# Altium project RF.PrjPcb
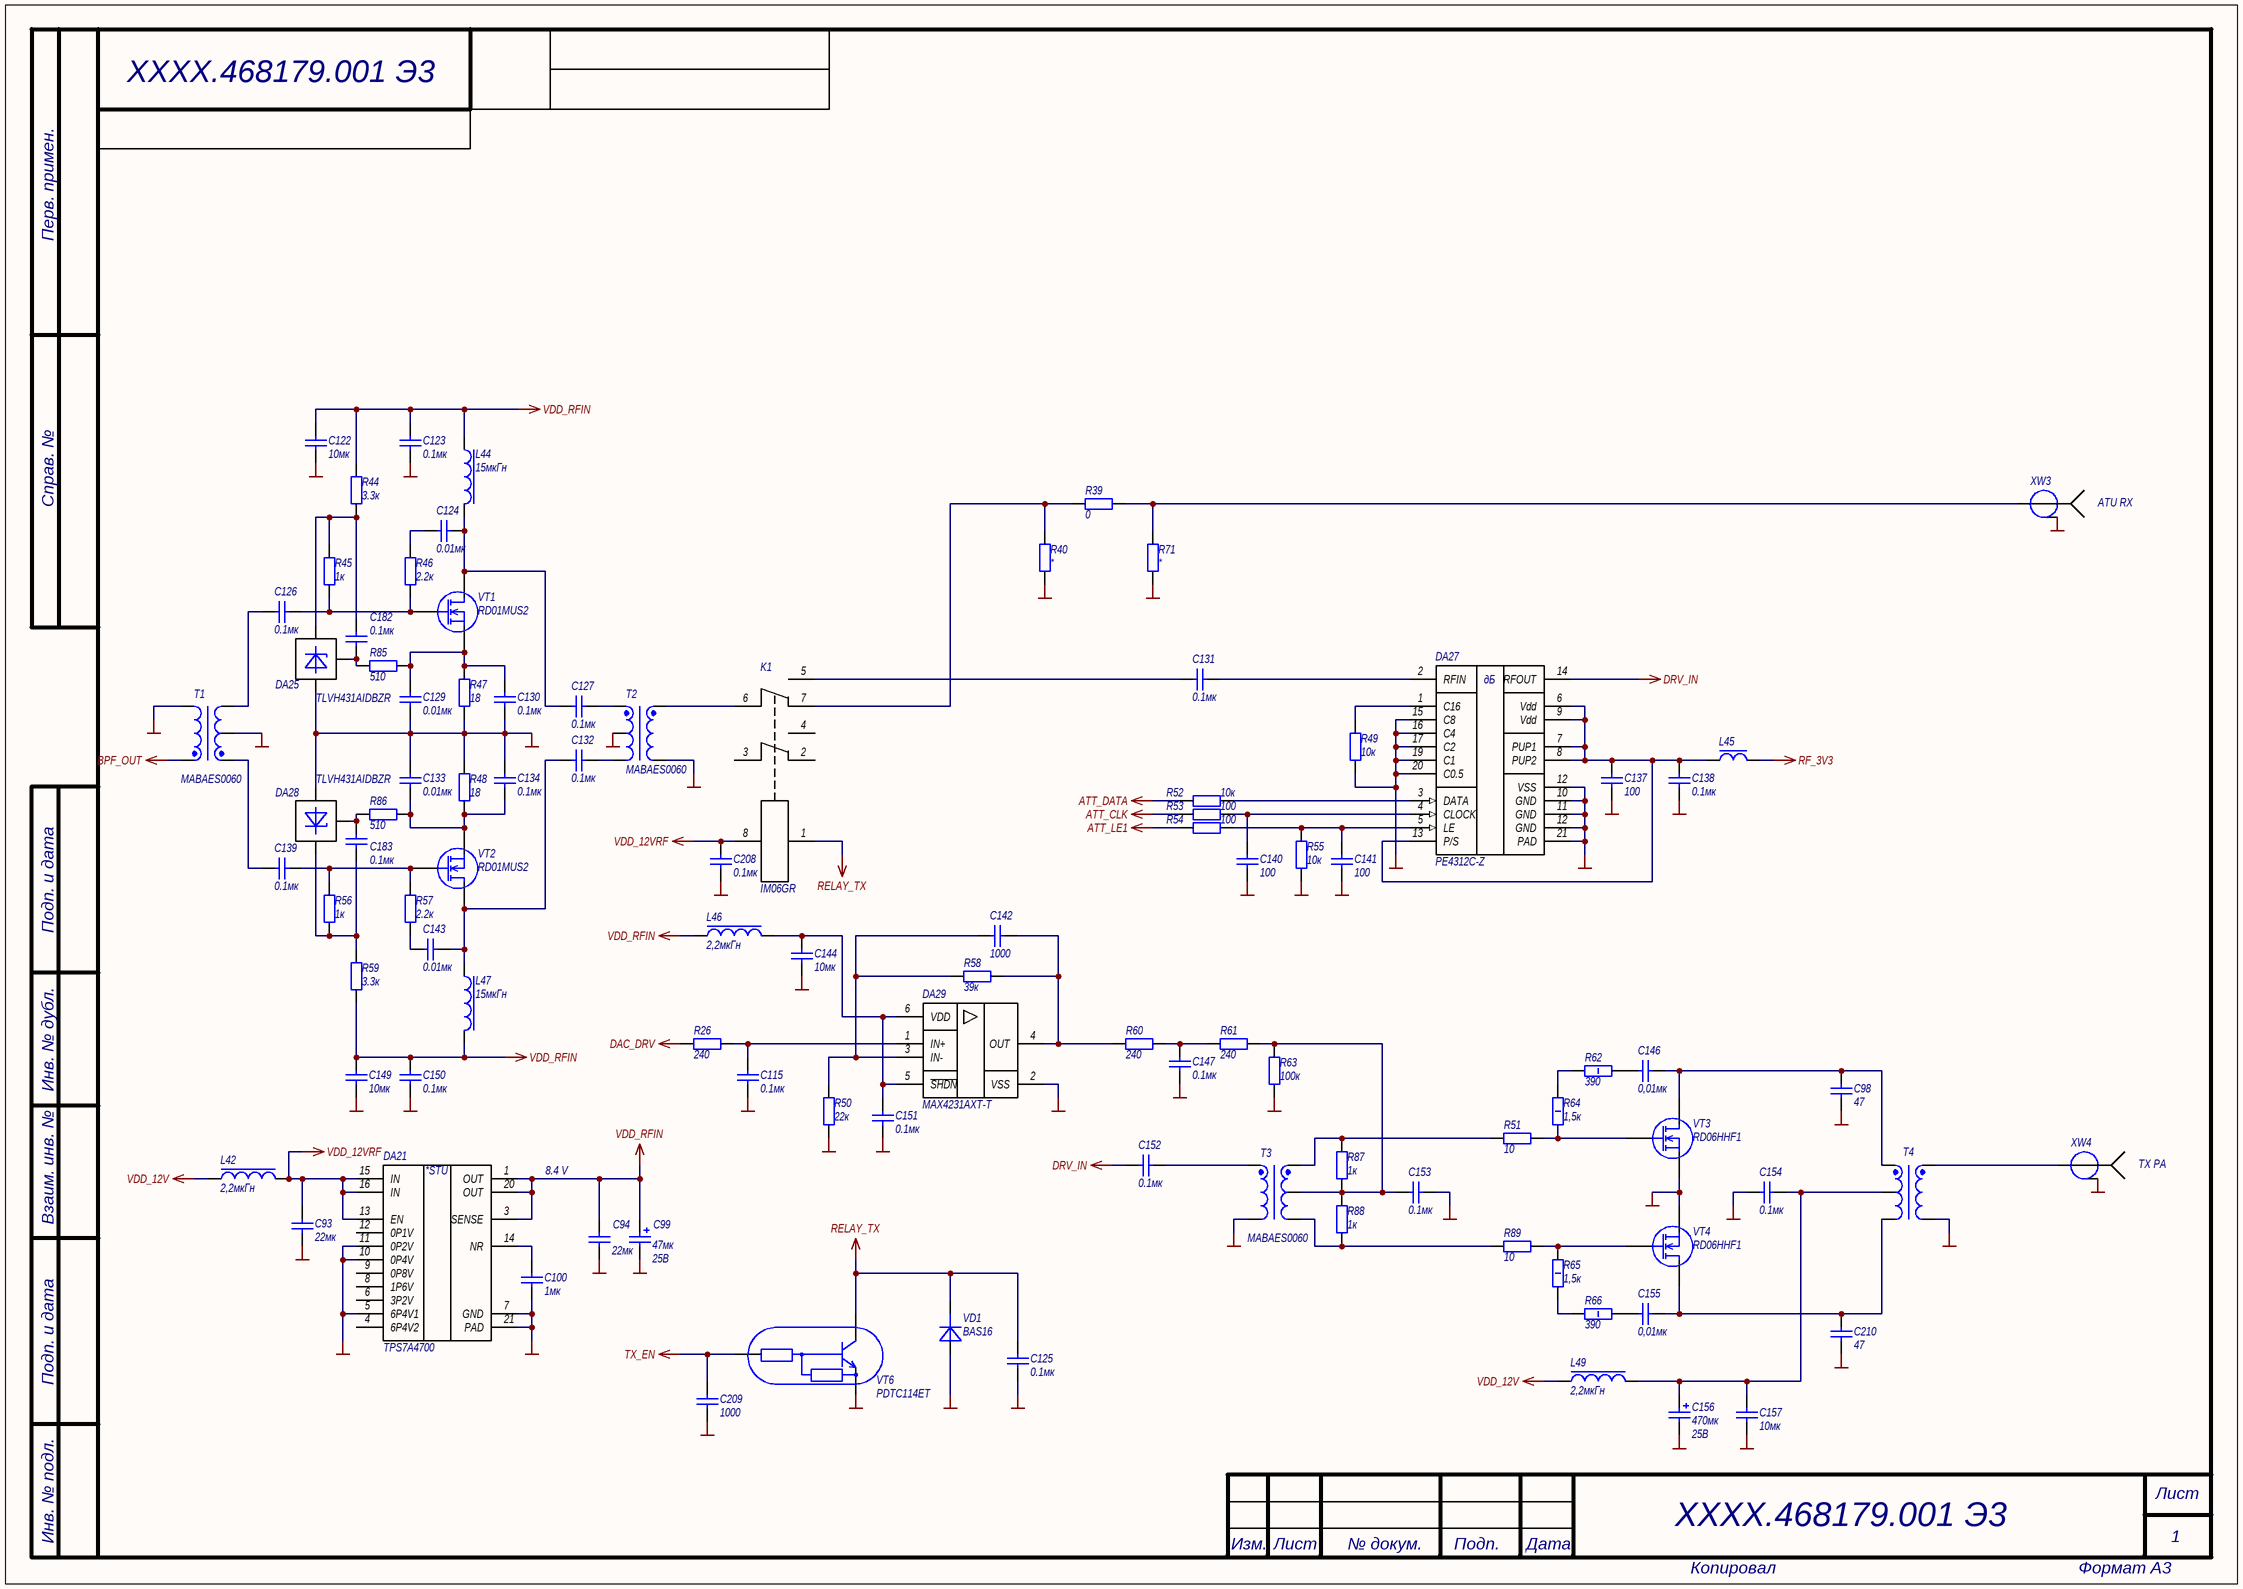
[diagram p0: RF_drv_v2.SchDoc]
3 sheets, 384 parts. Net scope: global (net labels, ports and power ports of the same name join across sheets).
Board file: RF_v2.PcbDoc
Sheets:
  RF_drv_v2.SchDoc
  RF_in_v2.SchDoc
  RF_pwr_v2.SchDoc

## Sheet RF_drv_v2.SchDoc: Материнская плата
size 420 x 297 mm; DrawnBy: В.Титов; DocumentNumber: ХХХХ.468179.001 Э3; SheetNumber: 1; SheetTotal: 3; DocumentType: Схема электрическая принципиальная; Title2: Питание процессора

### Parts
C93  22мк  [CAPC2012X12L]
C94  22мк  [CAPC2012X12L]
C98  47  [CAPC3216X19L]
C99  Power/Voltage: 25В  [CAPMP7343X28L]  (hidden comment: 47мк)
C100  1мк  [CAPC1005X06N]
C115  0.1мк  [CAPC1005X06N]
C122  10мк  [CAPC3225X27L]
C123  0.1мк  [CAPC1005X06N]
C124  0.01мк  [CAPC1005X06N]
C125  0.1мк  [CAPC1005X06N]
C126  0.1мк  [CAPC1005X06N]
C127  0.1мк  [CAPC1608X08L]
C129  0.01мк  [CAPC1005X06N]
C130  0.1мк  [CAPC1005X06N]
C131  0.1мк  [CAPC1608X08L]
C132  0.1мк  [CAPC1608X08L]
C133  0.01мк  [CAPC1005X06N]
C134  0.1мк  [CAPC1005X06N]
C137  100  [CAPC1005X06N]
C138  0.1мк  [CAPC1005X06N]
C139  0.1мк  [CAPC1005X06N]
C140  100  [CAPC1005X06N]
C141  100  [CAPC1005X06N]
C142  1000  [CAPC1005X06N]
C143  0.01мк  [CAPC1005X06N]
C144  10мк  [CAPC3225X27L]
C146  0,01мк  [CAPC2012X12L]
C147  0.1мк  [CAPC1005X06N]
C149  10мк  [CAPC3225X27L]
C150  0.1мк  [CAPC1005X06N]
C151  0.1мк  [CAPC1005X06N]
C152  0.1мк  [CAPC1608X08L]
C153  0.1мк  [CAPC1608X08L]
C154  0.1мк  [CAPC1608X08L]
C155  0,01мк  [CAPC2012X12L]
C156  Power/Voltage: 25В  [CAPAE116103X105N]  (hidden comment: 470мк)
C157  10мк  [CAPC3225X27L]
C182  0.1мк  [CAPC1005X06N]
C183  0.1мк  [CAPC1005X06N]
C208  0.1мк  [CAPC1005X06N]
C209  1000  [CAPC1005X06N]
C210  47  [CAPC3216X19L]
DA21  TPS7A4700  [QFN65P500X500X100_HS-21L]
DA25  TLVH431AIDBZR  [SOT23_N]
DA27  PE4312C-Z  [QFN50P400X400X80_HS-21L]
DA28  TLVH431AIDBZR  [SOT23_N]
DA29  MAX4231AXT-T  [TSOP65P210X100-6L]
K1  IM06GR  [IM Relay GR]
L42  2,2мкГн  [CSAB0420]
L44  15мкГн  [Coilcraft-1812FS]
L45  BLM18PG121SN1D  [INDC1608X08L]  (value not drawn)
L46  2,2мкГн  [CSAB0420]
L47  15мкГн  [Coilcraft-1812FS]
L49  2,2мкГн  [CSAB0420]
R26  240  [RESC1005X06N]
R39  0  [RESC1005X06N]
R40  *  [RESC1005X06N]
R44  3.3к  [RESC1005X06N]
R45  1к  [RESC1005X06N]
R46  2.2к  [RESC1005X06N]
R47  18  [RESC2012X05L]
R48  18  [RESC2012X05L]
R49  10к  [RESC1005X06N]
R50  22к  [RESC1005X06N]
R51  10  [RESC1005X06N]
R52  10к  [RESC1005X06N]
R53  100  [RESC1005X06N]
R54  100  [RESC1005X06N]
R55  10к  [RESC1005X06N]
R56  1к  [RESC1005X06N]
R57  2.2к  [RESC1005X06N]
R58  39к  [RESC1005X06N]
R59  3.3к  [RESC1005X06N]
R60  240  [RESC1005X06N]
R61  240  [RESC1005X06N]
R62  390  [RESC3216X04L]
R63  100к  [RESC1005X06N]
R64  1,5к  [RESC3216X04L]
R65  1,5к  [RESC3216X04L]
R66  390  [RESC3216X04L]
R71  *  [RESC1005X06N]
R85  510  [RESC1005X06N]
R86  510  [RESC1005X06N]
R87  1к  [RESC1005X06N]
R88  1к  [RESC1005X06N]
R89  10  [RESC1005X06N]
T1  MABAES0060  [SM-22 package]
T2  MABAES0060  [SM-22 package]
T3  MABAES0060  [SM-22 package]
T4  Трансформатор PUM_OUT  [Transformer_KV_PA20_0UT_2xBN-43-302_V1]  (value not drawn)
VD1  BAS16  [SOT23_N]
VT1  RD01MUS2  [SOT89-150P330X160-3N]
VT2  RD01MUS2  [SOT89-150P330X160-3N]
VT3  RD06HHF1  [TO-220HS]
VT4  RD06HHF1  [TO-220HS]
VT6  PDTC114ET  [SOT23_N]
XW3  SMA-JR  [SMA-JR]  (value not drawn)
XW4  SMA-JR  [SMA-JR]  (value not drawn)

### Nets
ATT_CLK: R53.2
ATT_DATA: R52.2
ATT_LE1: R54.2
BPF_OUT: T1.5(PRIMARY_DOT)
DAC_DRV: R26.1
DRV_IN: C152.2 DA27.14(RFOUT)
GND: C93.1 C94.1 C98.2 C99.2 C100.1 C115.2 C122.1 C123.2 C125.2 C129.2 C130.2 C133.1 C134.1 C137.1 C138.1 C140.1 C141.1 C144.1 C147.2 C149.1 C150.2 C151.2 C153.1 C154.1 C156.2 C157.1 C208.2 C209.2 C210.2 DA21.5(6P4V1) DA21.7(GND) DA21.10(0P4V) DA21.11(0P2V) DA21.21(PAD) DA25.3(A) DA27.10(GND) DA27.11(GND) DA27.12(VSS) DA27.15(C8) DA27.16(C4) DA27.17(C2) DA27.19(C1) DA27.20(C0.5) DA27.21(PAD) DA28.3(A) DA29.2(VSS) R40.2 R47.2 R48.1 R49.1 R50.1 R55.2 R63.2 R71.2 T1.2(SECONARY_CT) T1.4(PRIMARY) T2.2(SECONARY_CT) T2.4(PRIMARY) T3.4(PRIMARY) T4.5(SECONDARY) VD1.1(A) VT3.2(S) VT4.2(S) VT6.2(E) XW3.2 XW4.2
RELAY_TX: C125.1 K1.1 VD1.3(K) VT6.3(C)
RF_3V3: L45.2
TX_EN: C209.1 VT6.1(B)
VDD_12V: L42.1 L49.1
VDD_12VRF: C93.2 C208.1 DA21.13(EN) DA21.15(IN) DA21.16(IN) K1.8 L42.2
VDD_RFIN: C94.2 C99.1 C122.2 C123.1 C149.2 C150.1 DA21.1(OUT) DA21.3(SENSE) DA21.20(OUT) L44.1 L46.1 L47.2 R44.2 R59.1
NetC98_1: C98.1 C146.1 T4.3(PRIMARY_DOT) VT3.3(D)
NetC100_2: C100.2 DA21.14(NR)
NetC115_1: C115.1 DA29.1(IN+) R26.2
NetC124_1: C124.1 R46.1
NetC124_2: C124.2 C127.2 L44.2 VT1.3(D)
NetC126_1: C126.1 R45.2 R46.2 VT1.1(GATE)
NetC126_2: C126.2 T1.3(SECONDARY)
NetC127_1: C127.1 T2.1(SECONDARY_DOT)
NetC129_1: C129.1 C130.1 R47.1 R85.2 VT1.2(S)
NetC131_1: C131.1 DA27.2(RFIN)
NetC131_2: C131.2 K1.5
NetC132_1: C132.1 T2.3(SECONDARY)
NetC132_2: C132.2 C143.2 L47.1 VT2.3(D)
NetC133_2: C133.2 C134.2 R48.2 R86.2 VT2.2(S)
NetC137_2: C137.2 C138.2 DA27.6(Vdd) DA27.7(PUP1) DA27.8(PUP2) DA27.9(Vdd) DA27.13(P/S) L45.1
NetC139_1: C139.1 R56.1 R57.1 VT2.1(GATE)
NetC139_2: C139.2 T1.1(SECONDARY_DOT)
NetC140_2: C140.2 DA27.4(CLOCK) R53.1
NetC141_2: C141.2 DA27.5(LE) R54.1 R55.1
NetC142_1: C142.1 DA29.3(IN-) R50.2 R58.1
NetC142_2: C142.2 DA29.4(OUT) R58.2 R60.1
NetC143_1: C143.1 R57.2
NetC144_2: C144.2 C151.1 DA29.5(GND) DA29.6(VDD) L46.2
NetC146_2: C146.2 R62.2
NetC147_1: C147.1 R60.2 R61.1
NetC152_1: C152.1 T3.5(PRIMARY_DOT)
NetC153_2: C153.2 R61.2 R63.1 R87.2 R88.1 T3.2(SECONARY_CT)
NetC154_2: C154.2 C156.1 C157.2 L49.2 T4.2(CT)
NetC155_1: C155.1 C210.1 T4.1(PRIMARY) VT4.3(D)
NetC155_2: C155.2 R66.2
NetC182_1: C182.1 DA25.2(K) R44.1 R45.1
NetC182_2: C182.2 DA25.1(REF) R85.1
NetC183_1: C183.1 DA28.1(REF) R86.1
NetC183_2: C183.2 DA28.2(K) R56.2 R59.2
NetDA27_1: DA27.1(C16) R49.2
NetDA27_3: DA27.3(DATA) R52.1
NetK1_6: K1.6 T2.5(PRIMARY_DOT)
NetK1_7: K1.7 R39.1 R40.1
NetR39_2: R39.2 R71.1 XW3.1
NetR51_1: R51.1 R87.1 T3.1(SECONDARY_DOT)
NetR51_2: R51.2 R64.1 VT3.1(GATE)
NetR62_1: R62.1 R64.2
NetR65_1: R65.1 R66.1
NetR65_2: R65.2 R89.2 VT4.1(GATE)
NetR88_2: R88.2 R89.1 T3.3(SECONDARY)
NetT4_4: T4.4(SECONDARY_DOT) XW4.1

Not connected (* = marked no-connect by the designer): DA21 4(6P4V2) 6(3P2V) 8(1P6V) 9(0P8V) 12(0P1V); K1 2 3 4

### Notes on the sheet
- ATU RX
- 8.4 V
- TX PA
- Перв. примен.
- Справ. №
- Подп. и дата
- Инв. № дубл.
- Взаим. инв. №
- Инв. № подл.
- Лист
- Изм.
- № докум.
- Подп.
- Дата
- Копировал
- Формат А3
- (in symbol Микросхема PE4312C-Z) дБ
- (in symbol Микросхема TPS7A4700RGW) *STU

### Library data of the parts
C93 C94 = Кер.ЧИП конд. 0805 22мкФ X5R 10% 16В: Кер. ЧИП-конденсатор; Manufacturer: TDK; ManufacturerPartNumber: C2012X5R1C226KT; Power/Voltage: 16В; TKE: X5R; Tolerance: ±10%; Value: 22мк
C98 C210 = Кер.ЧИП конд. 1206 47пФ NP0 5% 2000В: Кер. ЧИП-конденсатор; Manufacturer: WALSIN; ManufacturerPartNumber: 1206N470J202; Power/Voltage: 2000В; TKE: NP0; Tolerance: ±5%; Value: 47
C99 = Конденсатор танталовый SMD D case 47мкФ ±10% 25B: Тант. ЧИП-конденсатор; Tolerance: ±10%; Published: 8-Jun-2000; LatestRevisionDate: 29-May-2009; LatestRevisionNote: IPC-7351 Footprint Added.; Publisher: Altium Limited; PackageDescription: Chip Capacitor; PackageReference: тип D; Value: 47мк
C100 = Кер.ЧИП конд. 0402 1мкФ X5R 10%, 10В: Кер. ЧИП-конденсатор; Power/Voltage: 10В; TKE: X5R; Tolerance: ±10%; PackageReference: 0402; Value: 1мк
C115 C123 C125 C126 C130 C134 C138 C139 C147 C150 C151 C182 C183 C208 = Кер.ЧИП конд. 0402 0.1мкФ X7R 10%, 16В: Кер. ЧИП-конденсатор; Power/Voltage: 16В; TKE: X7R; Tolerance: ±10%; PackageReference: 0402; Value: 0.1мк
C122 C144 C149 C157 = Кер.ЧИП конд. 1210 10мкФ X5R 20% 50В: Кер. ЧИП-конденсатор; Manufacturer: Murata; ManufacturerPartNumber: GRM32ER71H106; Power/Voltage: 50В; TKE: X5R; Tolerance: ±20%; Value: 10мк
C124 C129 C133 C143 = Кер.ЧИП конд. 0402 0.01мкФ X7R 10%, 50В: Кер. ЧИП-конденсатор; Power/Voltage: 50В; TKE: X7R; Tolerance: ±20%; Value: 0.01мк
C127 C131 C132 C152-C154 = Кер.ЧИП конд. 0603 0.1мкФ X7R 10% 50В: Кер. ЧИП-конденсатор; Manufacturer: Murata; ManufacturerPartNumber: GRM188R71H104KA93D; Power/Voltage: 50В; TKE: X7R; Tolerance: ±10%; Value: 0.1мк
C137 C140 C141 = Кер.ЧИП конд. 0402 100пФ NPO 5%, 50В: Кер. ЧИП-конденсатор; Power/Voltage: 50В; TKE: NPO; Tolerance: ±5%; PackageReference: 0402; Value: 100
C142 C209 = Кер.ЧИП конд. 0402 1000пФ NP0 5%, 50В: Кер. ЧИП-конденсатор; Power/Voltage: 50В; TKE: NPO; Tolerance: ±5%; PackageReference: 0402; Value: 1000
C146 C155 = Кер.ЧИП конд. 0805 0,01 мкФ X7R 10% 250В: Кер. ЧИП-конденсатор; Manufacturer: Murate; ManufacturerPartNumber: GRM21BR72E103KW03; Power/Voltage: 250В; TKE: X7R; Tolerance: ±10%; Value: 0,01мк
C156 = Конденсатор гибридный SMD 470мкФ ±20% 25В: Гибридный ЧИП-конденсатор; ManufacturerPartNumber: EEHZK1E471P; Manufacturer: Panasonic; Tolerance: ±20%; Published: 8-Jun-2000; LatestRevisionDate: 29-May-2009; LatestRevisionNote: IPC-7351 Footprint Added.; Publisher: Altium Limited; PackageDescription: ZK series; PackageReference: ZK series; Value: 470мк
DA21 = Микросхема TPS7A4700RGW: 36-V, 1-A, 4-µVRMS, RF LDO Voltage Regulator; Manufacturer: TI; Value: TPS7A4700; ComponentLink1Description: datasheet; ComponentLink1URL: http://www.ti.com/lit/ds/symlink/tps7a47.pdf
DA25 DA28 = ЧИП регулятор TLVH431AIDBZR: Low-Voltage Adjustable Precision Shunt Regulator; Manufacturer: TI; Power/Voltage: 1.24В до 18В; ManufacturerPartNumber: TLVH431AIDBZR; Value: TLVH431AIDBZR; ComponentLink1Description: datasheet; ComponentLink1URL: https://www.ti.com/lit/ds/symlink/tlvh431a.pdf?ts=1606914625003&ref_url=https%253A%252F%252Fwww.google.com%252F
DA27 = Микросхема PE4312C-Z: RF Digital Step Attenuator 6-bit, 31.5 dB, 1 MHz–4 GHz; Manufacturer: Peregrine; Value: PE4312C-Z; ComponentLink1Description: datasheet; ComponentLink1URL: https://www.psemi.com/pdf/datasheets/pe4312ds.pdf
DA29 = Микросхема MAX4231AXT-T: High-Output-Drive, 10MHz, 10V/μs,  Rail-to-Rail I/O Op Amps with Shutdown in SC70; Manufacturer: MAXIM; Value: MAX4231AXT-T; ComponentLink1Description: datasheet; ComponentLink1URL: https://datasheets.maximintegrated.com/en/ds/MAX4230-MAX4234.pdf
K1 = Реле IM06GR: Signal Relay 12VDC; Value: IM06GR; ComponentLink1Description: datasheet; ComponentLink1URL: https://www.te.com/commerce/DocumentDelivery/DDEController?Action=srchrtrv&DocNm=1-1773734-7_IM_Relay_I_Type&DocType=DS&DocLang=English
L42 L46 L49 = ЧИП индуктивность CSAB0420-2R2M: Molding Power Choke; Manufacturer: Vishay; ManufacturerPartNumber: IHLP1616ABER1R0M11; Value: 2,2мкГн
L44 L47 = ЧИП индуктивность 1812FS-153: High SRF, High Current Inductors; Manufacturer: Сoilcraft; ManufacturerPartNumber: 1812PS-683KLC; Value: 15мкГн
L45 = ЧИП дроссель 0603 BLM18PG121SN1D: SMD EMI Suppression Filter EMIFIL; Manufacturer: Murata; ManufacturerPartNumber: BLM18PG121SN1D; Value: BLM18PG121SN1D
R26 R60 R61 = Чип резистор 0402 240 Ом, 5%: ЧИП-резистор; Tolerance: ±5%; TKE: 100 ppm/°С; PackageReference: 0402; Value: 240
R39 = Чип резистор 0402 0 Ом: ЧИП-резистор; Tolerance: ±5%; TKE: 100 ppm/°С; PackageReference: 0402; Value: 0
R40 R71 = Чип резистор 0402 *: ЧИП-резистор; Tolerance: ±5%; TKE: 100 ppm/°С; PackageReference: 0402; Value: *
R44 R59 = Чип резистор 0402 3,3 кОм, 5%: ЧИП-резистор; Tolerance: ±5%; TKE: 100 ppm/°С; PackageReference: 0402; Value: 3.3к
R45 R56 R87 R88 = Чип резистор 0402 1 кОм, 5%: ЧИП-резистор; Tolerance: ±5%; TKE: 100 ppm/°С; PackageReference: 0402; Value: 1к
R46 R57 = Чип резистор 0402 2,2 кОм, 5%: ЧИП-резистор; Tolerance: ±5%; TKE: 100 ppm/°С; PackageReference: 0402; Value: 2.2к
R47 R48 = Чип резистор 0805 18 Ом, 5%: ЧИП-резистор; Tolerance: ±5%; TKE: 100 ppm/°С; PackageReference: 0805; Value: 18
R49 R52 R55 = Чип резистор 0402 10 кОм, 5%: ЧИП-резистор; Tolerance: ±5%; TKE: 100 ppm/°С; PackageReference: 0402; Value: 10к
R50 = Чип резистор 0402 22 кОм, 5%: ЧИП-резистор; Tolerance: ±5%; TKE: 100 ppm/°С; PackageReference: 0402; Value: 22к
R51 R89 = Чип резистор 0402 10 Ом, 5%: ЧИП-резистор; Tolerance: ±5%; TKE: 100 ppm/°С; PackageReference: 0402; Value: 10
R53 R54 = Чип резистор 0402 100 Ом, 5%: ЧИП-резистор; Tolerance: ±5%; TKE: 100 ppm/°С; PackageReference: 0402; Value: 100
R58 = Чип резистор 0402 39 кОм, 5%: ЧИП-резистор; Tolerance: ±5%; TKE: 100 ppm/°С; PackageReference: 0402; Value: 39к
R62 R66 = Чип резистор 1206 390 Ом, 5%: ЧИП-резистор; Manufacturer: ROHM; Tolerance: ±5%; TKE: 300 ppm/°С; PackageReference: 1206; Value: 390
R63 = Чип резистор 0402 100 кОм, 5%: ЧИП-резистор; Tolerance: ±5%; TKE: 100 ppm/°С; PackageReference: 0402; Value: 100к
R64 R65 = Чип резистор 1206 1,5 кОм, 5%: ЧИП-резистор; Manufacturer: ROHM; Tolerance: ±5%; TKE: 300 ppm/°С; PackageReference: 1206; Value: 1,5к
R85 R86 = Чип резистор 0402 510 Ом, 5%: ЧИП-резистор; Tolerance: ±5%; TKE: 100 ppm/°С; PackageReference: 0402; Value: 510
T1-T3 = ЧИП трансформатор MABAES0060: RF 1:1 Flux Coupled Transformer 0.3 - 200 MHz; Manufacturer: MACOM; Value: MABAES0060; ComponentLink1Description: datasheet; ComponentLink1URL: https://cdn.macom.com/datasheets/MABAES0060.pdf; ManufacturerPartNumber: MABAES0060
T4 = Transformer_KV_PA20_OUT: Трансформатор на 2 биноклях BN-43-302 (2843000302)mu850 / Первичная обмотка - плетенка ПМЛ2х4 / Вторичная обмотка - 2 витка проводом МГТФ 0,12; Manufacturer: НЕЛС; Manufacturer Part Number: Трансформатор PUM_OUT АНЕЛ.671143.003; SubType: Трансформатор на бинокле; Package: 2xBN-43-302 (2843000302) 13.3x10.3 mm; Type: Трансформатор
VD1 = ЧИП диод BAS16: High-speed switching diodes; Manufacturer: Nexperia; Power/Voltage: 100В; ManufacturerPartNumber: BAS16; Value: BAS16; ComponentLink1Description: datasheet; ComponentLink1URL: https://assets.nexperia.com/documents/data-sheet/BAS16_SER.pdf
VT1 VT2 = ЧИП транзистор RD01MUS2: Silicon MOSFET Power Transistor 520MHz, 1W, 7.2V; ComponentLink1Description: datasheet; ComponentLink1URL: https://www.mitsubishielectric.com/semiconductors/hf/products/datasheet/rd01mus2.pdf; Value: RD01MUS2
VT3 VT4 = ЧИП транзистор RD06HHF1: Silicon MOSFET Power Transistor 30MHz,6W; ComponentLink1Description: datasheet; ComponentLink1URL: https://www.radio-kits.co.uk/radio-related/Linear_PA/RD06HHF1_REV040402.pdf; Value: RD06HHF1
VT6 = ЧИП транзистор PDTC114ET: NPN resistor-equipped transistors;  R1 = 10 k, R2 = 10; ComponentLink1Description: datasheet; ComponentLink1URL: https://assets.nexperia.com/documents/data-sheet/PDTC114E_SER.pdf; Value: PDTC114ET
XW3 XW4 = Соединитель коаксиальный SMA-JR: SMA-JR Разъем SMA гнездо на плату, прямой угол; Value: SMA-JR; ComponentLink1Description: datasheet; ComponentLink1URL: http://www.brownbear.ru/goods/2243.html

## Sheet RF_in_v2.SchDoc: Приемопередатчик  SDR200
size 420 x 297 mm; Author: В.Титов; DrawnBy: В.Титов; DocumentNumber: ХХХХ.468179.001 Э3; SheetNumber: 2; SheetTotal: 3; DocumentType: Схема электрическая принципиальная; Title2: Радиочастотная плата; Scale: 1:1
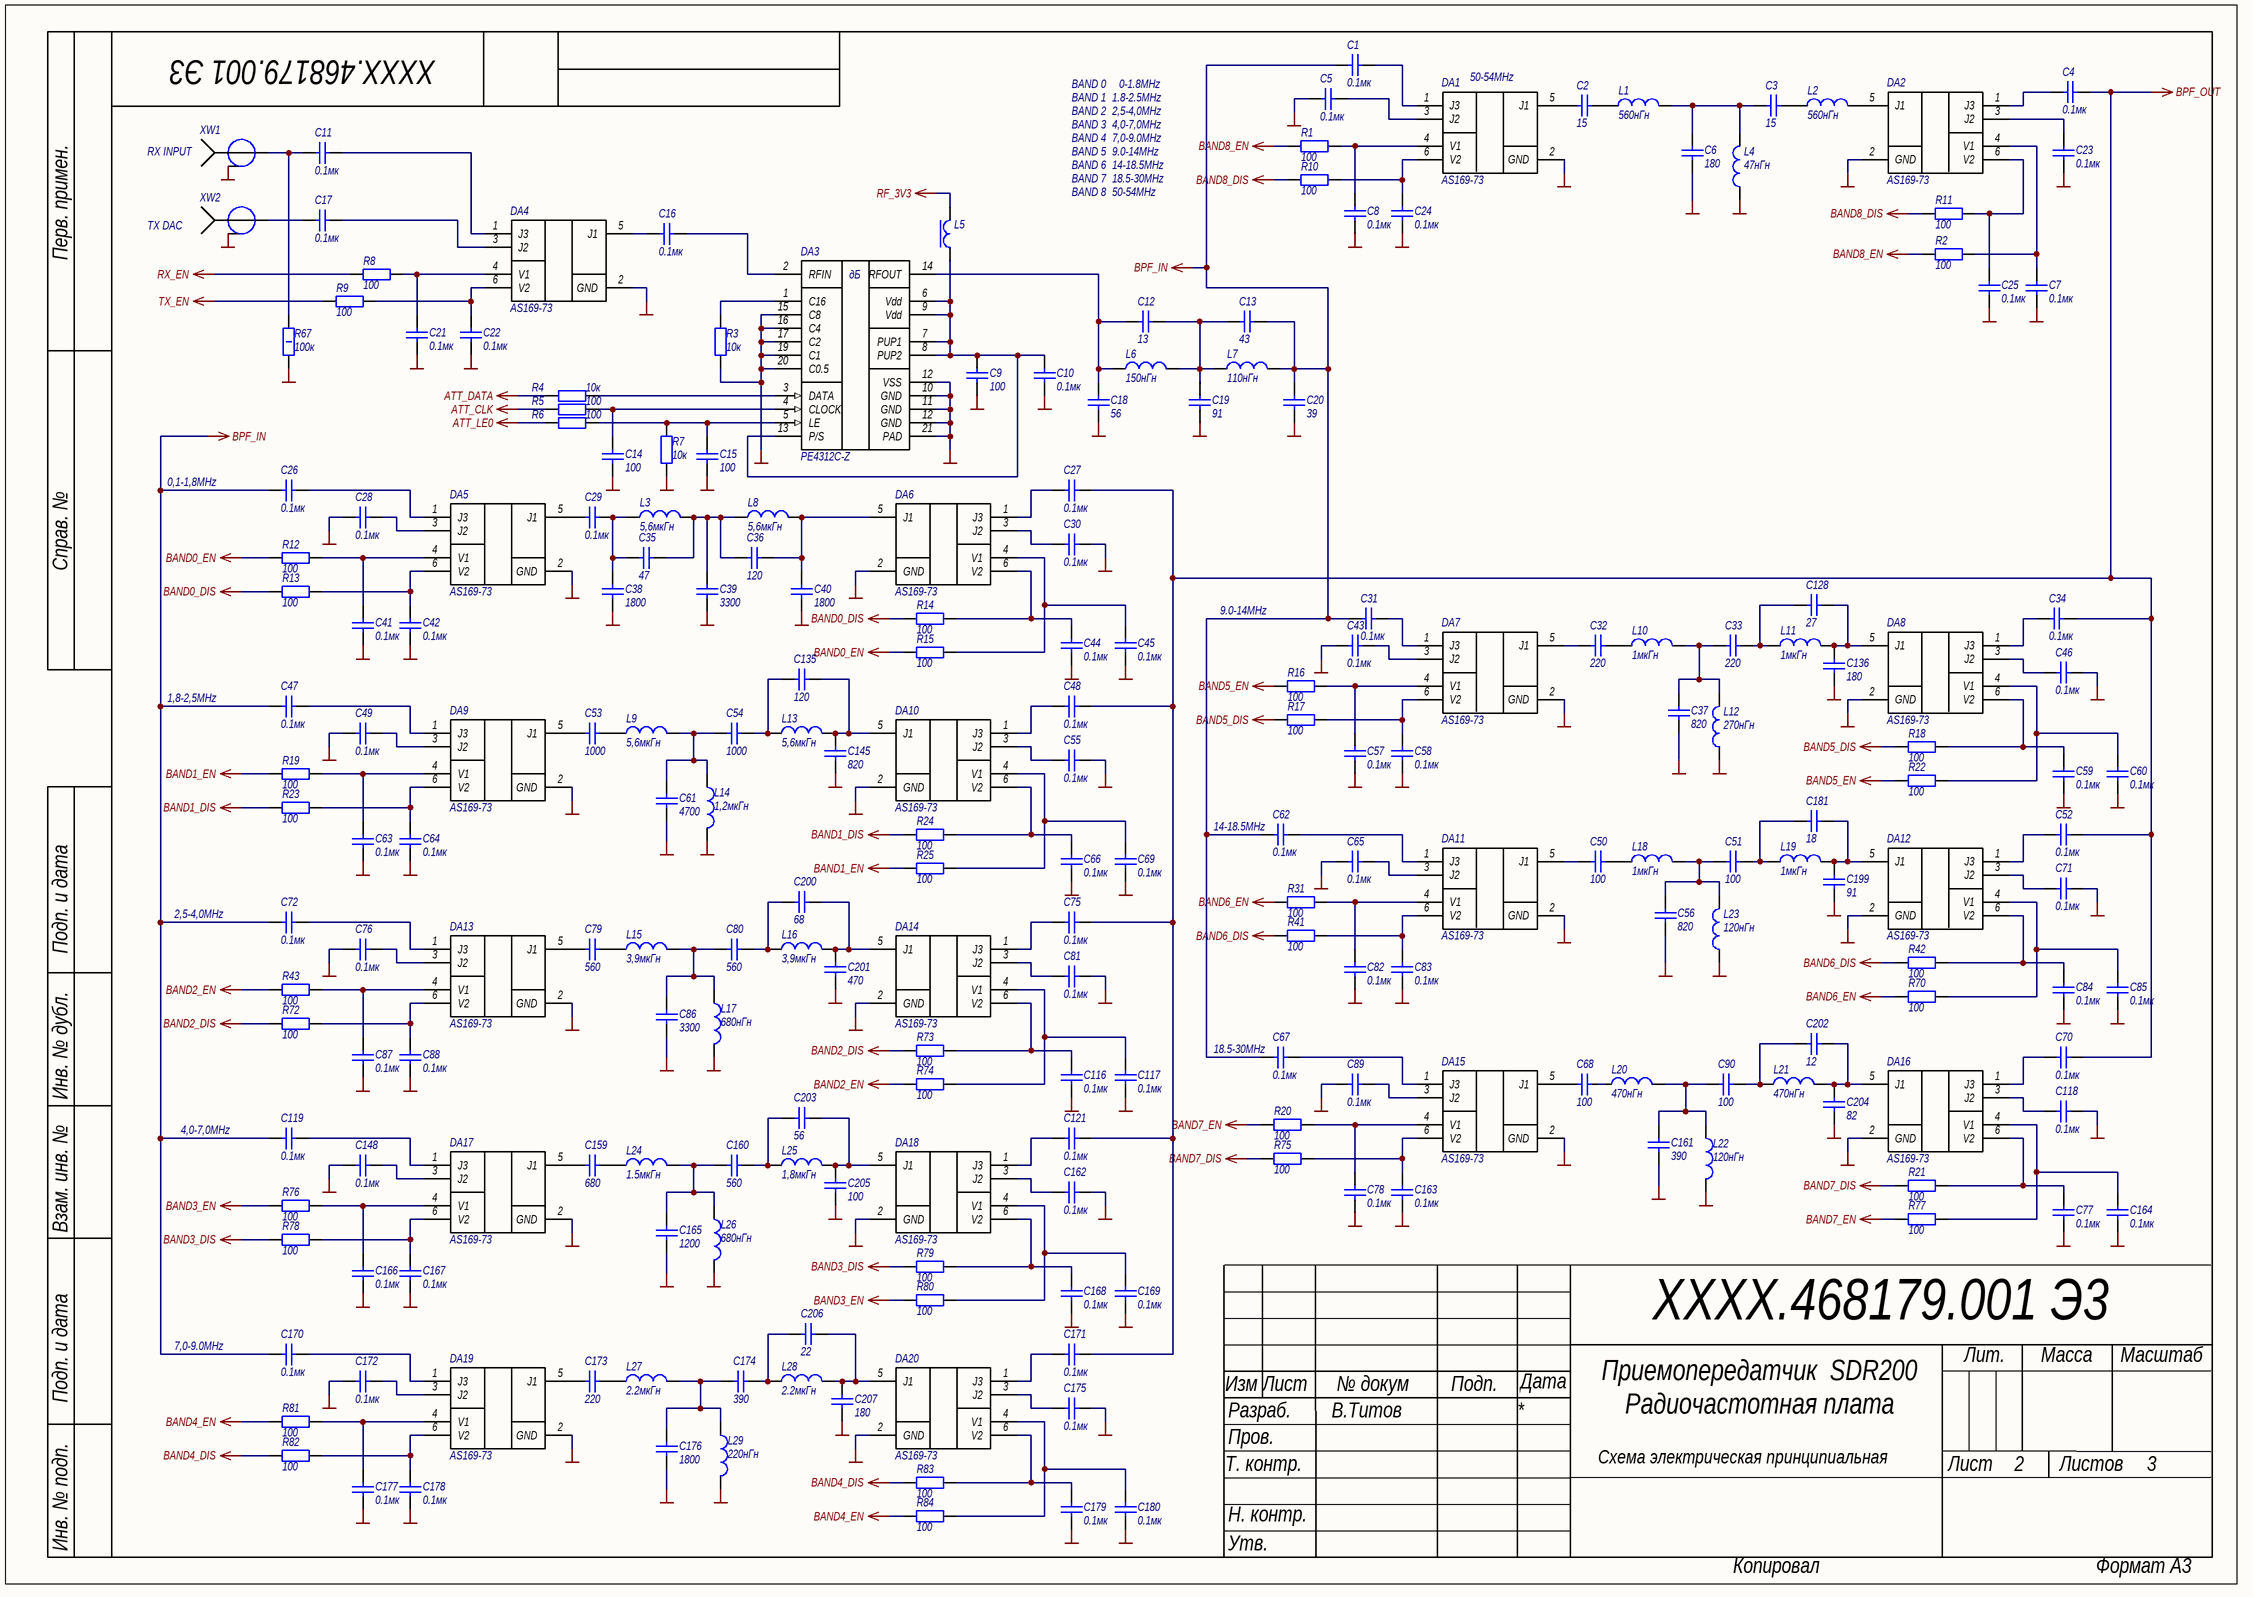
[diagram p1: RF_in_v2.SchDoc]

### Parts
C1  0.1мк  [CAPC1005X06N]
C2  15  [CAPC1005X06N]
C3  15  [CAPC1005X06N]
C4  0.1мк  [CAPC1005X06N]
C5  0.1мк  [CAPC1005X06N]
C6  180  [CAPC1005X06N]
C7  0.1мк  [CAPC1005X06N]
C8  0.1мк  [CAPC1005X06N]
C9  100  [CAPC1005X06N]
C10  0.1мк  [CAPC1005X06N]
C11  0.1мк  [CAPC1005X06N]
C12  13  [CAPC1005X06N]
C13  43  [CAPC1005X06N]
C14  100  [CAPC1005X06N]
C15  100  [CAPC1005X06N]
C16  0.1мк  [CAPC1005X06N]
C17  0.1мк  [CAPC1005X06N]
C18  56  [CAPC1005X06N]
C19  91  [CAPC1005X06N]
C20  39  [CAPC1005X06N]
C21  0.1мк  [CAPC1005X06N]
C22  0.1мк  [CAPC1005X06N]
C23  0.1мк  [CAPC1005X06N]
C24  0.1мк  [CAPC1005X06N]
C25  0.1мк  [CAPC1005X06N]
C26  0.1мк  [CAPC1005X06N]
C27  0.1мк  [CAPC1005X06N]
C28  0.1мк  [CAPC1005X06N]
C29  0.1мк  [CAPC1005X06N]
C30  0.1мк  [CAPC1005X06N]
C31  0.1мк  [CAPC1005X06N]
C32  220  [CAPC1005X06N]
C33  220  [CAPC1005X06N]
C34  0.1мк  [CAPC1005X06N]
C35  47  [CAPC1005X06N]
C36  120  [CAPC1005X06N]
C37  820  [CAPC1005X06N]
C38  1800  [CAPC1005X06N]
C39  3300  [CAPC1005X06N]
C40  1800  [CAPC1005X06N]
C41  0.1мк  [CAPC1005X06N]
C42  0.1мк  [CAPC1005X06N]
C43  0.1мк  [CAPC1005X06N]
C44  0.1мк  [CAPC1005X06N]
C45  0.1мк  [CAPC1005X06N]
C46  0.1мк  [CAPC1005X06N]
C47  0.1мк  [CAPC1005X06N]
C48  0.1мк  [CAPC1005X06N]
C49  0.1мк  [CAPC1005X06N]
C50  100  [CAPC1005X06N]
C51  100  [CAPC1005X06N]
C52  0.1мк  [CAPC1005X06N]
C53  1000  [CAPC1005X06N]
C54  1000  [CAPC1005X06N]
C55  0.1мк  [CAPC1005X06N]
C56  820  [CAPC1005X06N]
C57  0.1мк  [CAPC1005X06N]
C58  0.1мк  [CAPC1005X06N]
C59  0.1мк  [CAPC1005X06N]
C60  0.1мк  [CAPC1005X06N]
C61  4700  [CAPC1005X06N]
C62  0.1мк  [CAPC1005X06N]
C63  0.1мк  [CAPC1005X06N]
C64  0.1мк  [CAPC1005X06N]
C65  0.1мк  [CAPC1005X06N]
C66  0.1мк  [CAPC1005X06N]
C67  0.1мк  [CAPC1005X06N]
C68  100  [CAPC1005X06N]
C69  0.1мк  [CAPC1005X06N]
C70  0.1мк  [CAPC1005X06N]
C71  0.1мк  [CAPC1005X06N]
C72  0.1мк  [CAPC1005X06N]
C75  0.1мк  [CAPC1005X06N]
C76  0.1мк  [CAPC1005X06N]
C77  0.1мк  [CAPC1005X06N]
C78  0.1мк  [CAPC1005X06N]
C79  560  [CAPC1005X06N]
C80  560  [CAPC1005X06N]
C81  0.1мк  [CAPC1005X06N]
C82  0.1мк  [CAPC1005X06N]
C83  0.1мк  [CAPC1005X06N]
C84  0.1мк  [CAPC1005X06N]
C85  0.1мк  [CAPC1005X06N]
C86  3300  [CAPC1005X06N]
C87  0.1мк  [CAPC1005X06N]
C88  0.1мк  [CAPC1005X06N]
C89  0.1мк  [CAPC1005X06N]
C90  100  [CAPC1005X06N]
C116  0.1мк  [CAPC1005X06N]
C117  0.1мк  [CAPC1005X06N]
C118  0.1мк  [CAPC1005X06N]
C119  0.1мк  [CAPC1005X06N]
C121  0.1мк  [CAPC1005X06N]
C128  27  [CAPC1005X06N]
C135  120  [CAPC1005X06N]
C136  180  [CAPC1005X06N]
C145  820  [CAPC1005X06N]
C148  0.1мк  [CAPC1005X06N]
C159  680  [CAPC1005X06N]
C160  560  [CAPC1005X06N]
C161  390  [CAPC1005X06N]
C162  0.1мк  [CAPC1005X06N]
C163  0.1мк  [CAPC1005X06N]
C164  0.1мк  [CAPC1005X06N]
C165  1200  [CAPC1005X06N]
C166  0.1мк  [CAPC1005X06N]
C167  0.1мк  [CAPC1005X06N]
C168  0.1мк  [CAPC1005X06N]
C169  0.1мк  [CAPC1005X06N]
C170  0.1мк  [CAPC1005X06N]
C171  0.1мк  [CAPC1005X06N]
C172  0.1мк  [CAPC1005X06N]
C173  220  [CAPC1005X06N]
C174  390  [CAPC1005X06N]
C175  0.1мк  [CAPC1005X06N]
C176  1800  [CAPC1005X06N]
C177  0.1мк  [CAPC1005X06N]
C178  0.1мк  [CAPC1005X06N]
C179  0.1мк  [CAPC1005X06N]
C180  0.1мк  [CAPC1005X06N]
C181  18  [CAPC1005X06N]
C199  91  [CAPC1005X06N]
C200  68  [CAPC1005X06N]
C201  470  [CAPC1005X06N]
C202  12  [CAPC1005X06N]
C203  56  [CAPC1005X06N]
C204  82  [CAPC1005X06N]
C205  100  [CAPC1005X06N]
C206  22  [CAPC1005X06N]
C207  180  [CAPC1005X06N]
DA1  AS169-73  [SOT95P270X145-6N]
DA2  AS169-73  [SOT95P270X145-6N]
DA3  PE4312C-Z  [QFN50P400X400X80_HS-21L]
DA4  AS169-73  [SOT95P270X145-6N]
DA5  AS169-73  [SOT95P270X145-6N]
DA6  AS169-73  [SOT95P270X145-6N]
DA7  AS169-73  [SOT95P270X145-6N]
DA8  AS169-73  [SOT95P270X145-6N]
DA9  AS169-73  [SOT95P270X145-6N]
DA10  AS169-73  [SOT95P270X145-6N]
DA11  AS169-73  [SOT95P270X145-6N]
DA12  AS169-73  [SOT95P270X145-6N]
DA13  AS169-73  [SOT95P270X145-6N]
DA14  AS169-73  [SOT95P270X145-6N]
DA15  AS169-73  [SOT95P270X145-6N]
DA16  AS169-73  [SOT95P270X145-6N]
DA17  AS169-73  [SOT95P270X145-6N]
DA18  AS169-73  [SOT95P270X145-6N]
DA19  AS169-73  [SOT95P270X145-6N]
DA20  AS169-73  [SOT95P270X145-6N]
L1  560нГн  [INDC0805CS]
L2  560нГн  [INDC0805CS]
L3  5,6мкГн  [Coilcraft-1008CS]
L4  47нГн  [INDC0805CS]
L5  BLM18PG121SN1D  [INDC1608X08L]  (value not drawn)
L6  150нГн  [INDC0805CS]
L7  110нГн  [INDC0805CS]
L8  5,6мкГн  [Coilcraft-1008CS]
L9  5,6мкГн  [Coilcraft-1008CS]
L10  1мкГн  [INDC0805CS]
L11  1мкГн  [INDC0805CS]
L12  270нГн  [INDC0805CS]
L13  5,6мкГн  [Coilcraft-1008CS]
L14  1,2мкГн  [Coilcraft-1008CS]
L15  3,9мкГн  [Coilcraft-1008CS]
L16  3,9мкГн  [Coilcraft-1008CS]
L17  680нГн  [INDC0805CS]
L18  1мкГн  [INDC0805CS]
L19  1мкГн  [INDC0805CS]
L20  470нГн  [INDC0805CS]
L21  470нГн  [INDC0805CS]
L22  120нГн  [INDC0805CS]
L23  120нГн  [INDC0805CS]
L24  1.5мкГн  [INDC0805CS]
L25  1,8мкГн  [INDC0805CS]
L26  680нГн  [INDC0805CS]
L27  2.2мкГн  [INDC0805CS]
L28  2.2мкГн  [INDC0805CS]
L29  220нГн  [INDC0805CS]
R1  100  [RESC1005X06N]
R2  100  [RESC1005X06N]
R3  10к  [RESC1005X06N]
R4  10к  [RESC1005X06N]
R5  100  [RESC1005X06N]
R6  100  [RESC1005X06N]
R7  10к  [RESC1005X06N]
R8  100  [RESC1005X06N]
R9  100  [RESC1005X06N]
R10  100  [RESC1005X06N]
R11  100  [RESC1005X06N]
R12  100  [RESC1005X06N]
R13  100  [RESC1005X06N]
R14  100  [RESC1005X06N]
R15  100  [RESC1005X06N]
R16  100  [RESC1005X06N]
R17  100  [RESC1005X06N]
R18  100  [RESC1005X06N]
R19  100  [RESC1005X06N]
R20  100  [RESC1005X06N]
R21  100  [RESC1005X06N]
R22  100  [RESC1005X06N]
R23  100  [RESC1005X06N]
R24  100  [RESC1005X06N]
R25  100  [RESC1005X06N]
R31  100  [RESC1005X06N]
R41  100  [RESC1005X06N]
R42  100  [RESC1005X06N]
R43  100  [RESC1005X06N]
R67  100к  [RESC3216X04L]
R70  100  [RESC1005X06N]
R72  100  [RESC1005X06N]
R73  100  [RESC1005X06N]
R74  100  [RESC1005X06N]
R75  100  [RESC1005X06N]
R76  100  [RESC1005X06N]
R77  100  [RESC1005X06N]
R78  100  [RESC1005X06N]
R79  100  [RESC1005X06N]
R80  100  [RESC1005X06N]
R81  100  [RESC1005X06N]
R82  100  [RESC1005X06N]
R83  100  [RESC1005X06N]
R84  100  [RESC1005X06N]
XW1  SMA-JR  [SMA-JR]  (value not drawn)
XW2  SMA-JR  [SMA-JR]  (value not drawn)

### Nets
ATT_CLK: R5.2
ATT_DATA: R4.2
ATT_LE0: R6.2
BAND0_DIS: R13.2 R14.1
BAND0_EN: R12.2 R15.1
BAND1_DIS: R23.2 R24.1
BAND1_EN: R19.2 R25.1
BAND2_DIS: R72.2 R73.1
BAND2_EN: R43.2 R74.1
BAND3_DIS: R78.2 R79.1
BAND3_EN: R76.2 R80.1
BAND4_DIS: R82.2 R83.1
BAND4_EN: R81.2 R84.1
BAND5_DIS: R17.2 R18.1
BAND5_EN: R16.2 R22.1
BAND6_DIS: R41.2 R42.1
BAND6_EN: R31.2 R70.1
BAND7_DIS: R21.1 R75.2
BAND7_EN: R20.2 R77.1
BAND8_DIS: R10.2 R11.2
BAND8_EN: R1.2 R2.2
BPF_IN: C1.2 C13.1 C20.2 C26.2 C31.2 C47.2 C62.2 C67.2 C72.2 C119.2 C170.2 L7.2
BPF_OUT: C4.1 C27.1 C34.1 C48.1 C52.1 C70.1 C75.1 C121.1 C171.1
GND: C5.2 C6.1 C7.2 C8.2 C9.1 C10.1 C14.1 C15.1 C18.1 C19.1 C20.1 C21.2 C22.2 C23.2 C24.2 C25.2 C28.2 C30.1 C37.1 C38.1 C39.1 C40.1 C41.2 C42.2 C43.2 C44.2 C45.2 C46.1 C49.2 C55.1 C56.1 C57.2 C58.2 C59.2 C60.2 C61.1 C63.2 C64.2 C65.2 C66.2 C69.2 C71.1 C76.2 C77.2 C78.2 C81.1 C82.2 C83.2 C84.2 C85.2 C86.1 C87.2 C88.2 C89.2 C116.2 C117.2 C118.1 C136.1 C145.1 C148.2 C161.1 C162.1 C163.2 C164.2 C165.1 C166.2 C167.2 C168.2 C169.2 C172.2 C175.1 C176.1 C177.2 C178.2 C179.2 C180.2 C199.1 C201.1 C204.1 C205.1 C207.1 DA1.2(GND) DA2.2(GND) DA3.10(GND) DA3.11(GND) DA3.12(VSS) DA3.15(C8) DA3.16(C4) DA3.17(C2) DA3.19(C1) DA3.20(C0.5) DA3.21(PAD) DA4.2(GND) DA5.2(GND) DA6.2(GND) DA7.2(GND) DA8.2(GND) DA9.2(GND) DA10.2(GND) DA11.2(GND) DA12.2(GND) DA13.2(GND) DA14.2(GND) DA15.2(GND) DA16.2(GND) DA17.2(GND) DA18.2(GND) DA19.2(GND) DA20.2(GND) L4.1 L12.1 L14.2 L17.2 L22.2 L23.1 L26.2 L29.2 R3.1 R7.2 R67.2 XW1.2 XW2.2
RF_3V3: L5.2
RX_EN: R8.2
TX_EN: R9.2
NetC1_1: C1.1 DA1.1(J3)
NetC2_1: C2.1 DA1.5(GND)
NetC2_2: C2.2 L1.1
NetC3_1: C3.1 C6.2 L1.2 L4.2
NetC3_2: C3.2 L2.1
NetC4_2: C4.2 DA2.1(J3)
NetC5_1: C5.1 DA1.3(J2)
NetC7_1: C7.1 DA2.4(V1) R2.1
NetC8_1: C8.1 DA1.4(V1) R1.1
NetC9_2: C9.2 C10.2 DA3.6(Vdd) DA3.7(PUP1) DA3.8(PUP2) DA3.9(Vdd) DA3.13(P/S) L5.1
NetC11_1: C11.1 DA4.1(J3)
NetC11_2: C11.2 R67.1 XW1.1
NetC12_1: C12.1 C13.2 C19.2 L6.2 L7.1
NetC12_2: C12.2 C18.2 DA3.14(RFOUT) L6.1
NetC14_2: C14.2 DA3.4(CLOCK) R5.1
NetC15_2: C15.2 DA3.5(LE) R6.1 R7.1
NetC16_1: C16.1 DA3.2(RFIN)
NetC16_2: C16.2 DA4.5(GND)
NetC17_1: C17.1 DA4.3(J2)
NetC17_2: C17.2 XW2.1
NetC21_1: C21.1 DA4.4(V1) R8.1
NetC22_1: C22.1 DA4.6(V2) R9.1
NetC23_1: C23.1 DA2.3(J2)
NetC24_1: C24.1 DA1.6(V2) R10.1
NetC25_1: C25.1 DA2.6(V2) R11.1
NetC26_1: C26.1 DA5.1(J3)
NetC27_2: C27.2 DA6.1(J3)
NetC28_1: C28.1 DA5.3(J2)
NetC29_1: C29.1 C35.1 C38.2 L3.1
NetC29_2: C29.2 DA5.5(GND)
NetC30_2: C30.2 DA6.3(J2)
NetC31_1: C31.1 DA7.1(J3)
NetC32_1: C32.1 DA7.5(GND)
NetC32_2: C32.2 L10.1
NetC33_1: C33.1 C37.2 L10.2 L12.2
NetC33_2: C33.2 C128.1 L11.1
NetC34_2: C34.2 DA8.1(J3)
NetC35_2: C35.2 C36.1 C39.2 L3.2 L8.1
NetC36_2: C36.2 C40.2 DA6.5(GND) L8.2
NetC41_1: C41.1 DA5.4(V1) R12.1
NetC42_1: C42.1 DA5.6(V2) R13.1
NetC43_1: C43.1 DA7.3(J2)
NetC44_1: C44.1 DA6.6(V2) R14.2
NetC45_1: C45.1 DA6.4(V1) R15.2
NetC46_2: C46.2 DA8.3(J2)
NetC47_1: C47.1 DA9.1(J3)
NetC48_2: C48.2 DA10.1(J3)
NetC49_1: C49.1 DA9.3(J2)
NetC50_1: C50.1 DA11.5(GND)
NetC50_2: C50.2 L18.1
NetC51_1: C51.1 C56.2 L18.2 L23.2
NetC51_2: C51.2 C181.1 L19.1
NetC52_2: C52.2 DA12.1(J3)
NetC53_1: C53.1 DA9.5(GND)
NetC53_2: C53.2 L9.1
NetC54_1: C54.1 C61.2 L9.2 L14.1
NetC54_2: C54.2 C135.1 L13.1
NetC55_2: C55.2 DA10.3(J2)
NetC57_1: C57.1 DA7.4(V1) R16.1
NetC58_1: C58.1 DA7.6(V2) R17.1
NetC59_1: C59.1 DA8.6(V2) R18.2
NetC60_1: C60.1 DA8.4(V1) R22.2
NetC62_1: C62.1 DA11.1(J3)
NetC63_1: C63.1 DA9.4(V1) R19.1
NetC64_1: C64.1 DA9.6(V2) R23.1
NetC65_1: C65.1 DA11.3(J2)
NetC66_1: C66.1 DA10.6(V2) R24.2
NetC67_1: C67.1 DA15.1(J3)
NetC68_1: C68.1 DA15.5(GND)
NetC68_2: C68.2 L20.1
NetC69_1: C69.1 DA10.4(V1) R25.2
NetC70_2: C70.2 DA16.1(J3)
NetC71_2: C71.2 DA12.3(J2)
NetC72_1: C72.1 DA13.1(J3)
NetC75_2: C75.2 DA14.1(J3)
NetC76_1: C76.1 DA13.3(J2)
NetC77_1: C77.1 DA16.6(V2) R21.2
NetC78_1: C78.1 DA15.4(V1) R20.1
NetC79_1: C79.1 DA13.5(GND)
NetC79_2: C79.2 L15.1
NetC80_1: C80.1 C86.2 L15.2 L17.1
NetC80_2: C80.2 C200.1 L16.1
NetC81_2: C81.2 DA14.3(J2)
NetC82_1: C82.1 DA11.4(V1) R31.1
NetC83_1: C83.1 DA11.6(V2) R41.1
NetC84_1: C84.1 DA12.6(V2) R42.2
NetC85_1: C85.1 DA12.4(V1) R70.2
NetC87_1: C87.1 DA13.4(V1) R43.1
NetC88_1: C88.1 DA13.6(V2) R72.1
NetC89_1: C89.1 DA15.3(J2)
NetC90_1: C90.1 C161.2 L20.2 L22.1
NetC90_2: C90.2 C202.1 L21.1
NetC116_1: C116.1 DA14.6(V2) R73.2
NetC117_1: C117.1 DA14.4(V1) R74.2
NetC118_2: C118.2 DA16.3(J2)
NetC119_1: C119.1 DA17.1(J3)
NetC121_2: C121.2 DA18.1(J3)
NetC128_2: C128.2 C136.2 DA8.5(GND) L11.2
NetC135_2: C135.2 C145.2 DA10.5(GND) L13.2
NetC148_1: C148.1 DA17.3(J2)
NetC159_1: C159.1 DA17.5(GND)
NetC159_2: C159.2 L24.1
NetC160_1: C160.1 C165.2 L24.2 L26.1
NetC160_2: C160.2 C203.1 L25.1
NetC162_2: C162.2 DA18.3(J2)
NetC163_1: C163.1 DA15.6(V2) R75.1
NetC164_1: C164.1 DA16.4(V1) R77.2
NetC166_1: C166.1 DA17.4(V1) R76.1
NetC167_1: C167.1 DA17.6(V2) R78.1
NetC168_1: C168.1 DA18.6(V2) R79.2
NetC169_1: C169.1 DA18.4(V1) R80.2
NetC170_1: C170.1 DA19.1(J3)
NetC171_2: C171.2 DA20.1(J3)
NetC172_1: C172.1 DA19.3(J2)
NetC173_1: C173.1 DA19.5(GND)
NetC173_2: C173.2 L27.1
NetC174_1: C174.1 C176.2 L27.2 L29.1
NetC174_2: C174.2 C206.1 L28.1
NetC175_2: C175.2 DA20.3(J2)
NetC177_1: C177.1 DA19.4(V1) R81.1
NetC178_1: C178.1 DA19.6(V2) R82.1
NetC179_1: C179.1 DA20.6(V2) R83.2
NetC180_1: C180.1 DA20.4(V1) R84.2
NetC181_2: C181.2 C199.2 DA12.5(GND) L19.2
NetC200_2: C200.2 C201.2 DA14.5(GND) L16.2
NetC202_2: C202.2 C204.2 DA16.5(GND) L21.2
NetC203_2: C203.2 C205.2 DA18.5(GND) L25.2
NetC206_2: C206.2 C207.2 DA20.5(GND) L28.2
NetDA2_5: DA2.5(GND) L2.2
NetDA3_1: DA3.1(C16) R3.2
NetDA3_3: DA3.3(DATA) R4.1

### Notes on the sheet
- BAND 0
- BAND 1
- BAND 2
- BAND 3
- 1.8-2.5MHz
- 2,5-4,0MHz
- 4,0-7,0MHz
- 0-1.8MHz
- (near DA1) 50-54MHz
- (near XW1) RX INPUT
- BAND 4
- BAND 5
- BAND 6
- BAND 7
- 7,0-9.0MHz
- 9.0-14MHz
- 14-18.5MHz
- 18.5-30MHz
- TX DAC
- BAND 8
- 50-54MHz
- 0,1-1,8MHz
- 1,8-2,5MHz
- (near C62) 14-18.5MHz
- (near C72) 2,5-4,0MHz
- (near C67) 18.5-30MHz
- (near C119) 4,0-7,0MHz
- (near C170) 7,0-9.0MHz
- Перв. примен.
- Справ. №
- Подп. и дата
- Инв. № дубл.
- Взам. инв. №
- Изм
- Лист
- № докум
- Подп.
- Дата
- Лит.
- Масса
- Масштаб
- Т. контр.
- Разраб.
- Пров.
- Листов
- Н. контр.
- Инв. № подп.
- Утв.
- Копировал
- Формат А3
- (in symbol Микросхема PE4312C-Z) дБ

### Library data of the parts
C1 C4 C5 C7 C8 C10 C11 C16 C17 C21-C31 C34 C41-C49 C52 C55 C57-C60 C62-C67 C69-C72 C75-C78 C81-C85 C87-C89 C116-C119 C121 C148 C162-C164 C166-C172 C175 C177-C180 = Кер.ЧИП конд. 0402 0.1мкФ X7R 10%, 16В: as C115 on sheet RF_drv_v2; PackageReference: 0402; Value: 0.1мк
C2 C3 = Кер.ЧИП конд. 0402 15пФ NPO 5%, 50В: Кер. ЧИП-конденсатор; Power/Voltage: 50В; TKE: NPO; Tolerance: ±5%; Value: 15; PackageReference: 0402
C6 C136 C207 = Кер.ЧИП конд. 0402 180пФ NPO 5%, 50В: Кер. ЧИП-конденсатор; Power/Voltage: 50В; TKE: NPO; Tolerance: ±5%; Value: 180; PackageReference: 0402
C9 C14 C15 C50 C51 C68 C90 C205 = Кер.ЧИП конд. 0402 100пФ NPO 5%, 50В: as C137 on sheet RF_drv_v2; PackageReference: 0402; Value: 100
C12 = Кер.ЧИП конд. 0402 13пФ NPO 5%, 50В: Кер. ЧИП-конденсатор; Power/Voltage: 50В; TKE: NPO; Tolerance: ±5%; PackageReference: 0402; Value: 13
C13 = Кер.ЧИП конд. 0402 43пФ NPO 5%, 50В: Кер. ЧИП-конденсатор; Power/Voltage: 50В; TKE: NPO; Tolerance: ±5%; PackageReference: 0402; Value: 43
C18 C203 = Кер.ЧИП конд. 0402 56пФ NPO 5%, 50В: Кер. ЧИП-конденсатор; Power/Voltage: 50В; TKE: NPO; Tolerance: ±5%; PackageReference: 0402; Value: 56
C19 C199 = Кер.ЧИП конд. 0402 91пФ NPO 5%, 50В: Кер. ЧИП-конденсатор; Power/Voltage: 50В; TKE: NPO; Tolerance: ±5%; PackageReference: 0402; Value: 91
C20 = Кер.ЧИП конд. 0402 39пФ NPO 5%, 50В: Кер. ЧИП-конденсатор; Power/Voltage: 50В; TKE: NPO; Tolerance: ±5%; PackageReference: 0402; Value: 39
C32 C33 C173 = Кер.ЧИП конд. 0402 220пФ NPO 5%, 50В: Кер. ЧИП-конденсатор; Power/Voltage: 50В; TKE: NPO; Tolerance: ±5%; Value: 220; PackageReference: 0402
C35 = Кер.ЧИП конд. 0402 47пФ NPO 5%, 50В: Кер. ЧИП-конденсатор; Power/Voltage: 50В; TKE: NPO; Tolerance: ±5%; Value: 47; PackageReference: 0402
C36 C135 = Кер.ЧИП конд. 0402 120пФ NPO 5%, 50В: Кер. ЧИП-конденсатор; Power/Voltage: 50В; TKE: NPO; Tolerance: ±5%; Value: 120; PackageReference: 0402
C37 C56 C145 = Кер.ЧИП конд. 0402 820пФ NP0 5%, 50В: Кер. ЧИП-конденсатор; Power/Voltage: 50В; TKE: NPO; Tolerance: ±5%; Value: 820; PackageReference: 0402
C38 C40 C176 = Кер.ЧИП конд. 0402 1800пФ X7R 10%, 50В: Кер. ЧИП-конденсатор; Power/Voltage: 50В; TKE: X7R; Tolerance: ±20%; Value: 1800
C39 C86 = Кер.ЧИП конд. 0402 3300пФ X7R 10%, 50В: Кер. ЧИП-конденсатор; Power/Voltage: 50В; TKE: X7R; Tolerance: ±20%; Value: 3300
C53 C54 = Кер.ЧИП конд. 0402 1000пФ NP0 5%, 50В: as C142 on sheet RF_drv_v2; Value: 1000; PackageReference: 0402
C61 = Кер.ЧИП конд. 0402 4700пФ X7R 10%, 50В: Кер. ЧИП-конденсатор; Power/Voltage: 50В; TKE: X7R; Tolerance: ±20%; Value: 4700
C79 C80 C160 = Кер.ЧИП конд. 0402 560пФ NP0 5%, 50В: Кер. ЧИП-конденсатор; Power/Voltage: 50В; TKE: NPO; Tolerance: ±5%; Value: 560; PackageReference: 0402
C128 = Кер.ЧИП конд. 0402 27пФ NPO 5%, 50В: Кер. ЧИП-конденсатор; Power/Voltage: 50В; TKE: NPO; Tolerance: ±5%; Value: 27; PackageReference: 0402
C159 = Кер.ЧИП конд. 0402 680пФ NP0 5%, 50В: Кер. ЧИП-конденсатор; Power/Voltage: 50В; TKE: NPO; Tolerance: ±5%; Value: 680; PackageReference: 0402
C161 C174 = Кер.ЧИП конд. 0402 390пФ NP0 5%, 50В: Кер. ЧИП-конденсатор; Power/Voltage: 50В; TKE: NPO; Tolerance: ±5%; Value: 390; PackageReference: 0402
C165 = Кер.ЧИП конд. 0402 1200пФ X7R 10%, 50В: Кер. ЧИП-конденсатор; Power/Voltage: 50В; TKE: X7R; Tolerance: ±20%; Value: 1200
C181 = Кер.ЧИП конд. 0402 18пФ NPO 5%, 50В: Кер. ЧИП-конденсатор; Power/Voltage: 50В; TKE: NPO; Tolerance: ±5%; Value: 18; PackageReference: 0402
C200 = Кер.ЧИП конд. 0402 68пФ NPO 5%, 50В: Кер. ЧИП-конденсатор; Power/Voltage: 50В; TKE: NPO; Tolerance: ±5%; Value: 68; PackageReference: 0402
C201 = Кер.ЧИП конд. 0402 470пФ NP0 5%, 50В: Кер. ЧИП-конденсатор; Power/Voltage: 50В; TKE: NPO; Tolerance: ±5%; Value: 470; PackageReference: 0402
C202 = Кер.ЧИП конд. 0402 12пФ NPO 5%, 50В: Кер. ЧИП-конденсатор; Power/Voltage: 50В; TKE: NPO; Tolerance: ±5%; Value: 12; PackageReference: 0402
C204 = Кер.ЧИП конд. 0402 82пФ NPO 5%, 50В: Кер. ЧИП-конденсатор; Power/Voltage: 50В; TKE: NPO; Tolerance: ±5%; Value: 82; PackageReference: 0402
C206 = Кер.ЧИП конд. 0402 22пФ NPO 5%, 50В: Кер. ЧИП-конденсатор; Power/Voltage: 50В; TKE: NPO; Tolerance: ±5%; Value: 22; PackageReference: 0402
DA1 DA2 DA4-DA20 = Микросхема AS169-73: PHEMT GaAs IC SPDT Switch 300 kHz–2.5 GHz; Manufacturer: Qorvo; Value: AS169-73; ComponentLink1Description: product page; ComponentLink1URL: https://www.skyworksinc.com/Products/switches/AS169-73LF
DA3 = Микросхема PE4312C-Z: as DA27 on sheet RF_drv_v2; Value: PE4312C-Z; ComponentLink1Description: datasheet; ComponentLink1URL: https://www.psemi.com/pdf/datasheets/pe4312ds.pdf
L1 L2 = ЧИП индуктивность 0805CS-561X: Value: 560нГн
L3 L8 L9 L13 = ЧИП индуктивность 1008CS-562X_: Chip Inductors–1008CS Series (2520); Manufacturer: Сoilcraft; ManufacturerPartNumber: 1008CS-562X_E_; Value: 5,6мкГн
L4 = ЧИП индуктивность 0805CS-470X: Value: 47нГн
L5 = ЧИП дроссель 0603 BLM18PG121SN1D: as L45 on sheet RF_drv_v2; ManufacturerPartNumber: BLM18PG121SN1D; Value: BLM18PG121SN1D
L6 = ЧИП индуктивность 0805CS-151XGL: Value: 150нГн
L7 = ЧИП индуктивность 0805CS-111XGL: Value: 110нГн
L10 L11 L18 L19 = ЧИП индуктивность 0805CS-102X: Value: 1мкГн
L12 = ЧИП индуктивность 0805CS-271X: Value: 270нГн
L14 = ЧИП индуктивность 1008CS-122X: Chip Inductors–1008CS Series (2520); Manufacturer: Сoilcraft; Value: 1,2мкГн; ManufacturerPartNumber: 1008CS-122X
L15 = ЧИП индуктивность 1008CS-392X: Chip Inductors–1008CS Series (2520); Manufacturer: Сoilcraft; ManufacturerPartNumber: 1008CS-391X_E_; Value: 3,9мкГн
L16 = ЧИП индуктивность 1008CS-392X: Chip Inductors–1008CS Series (2520); Manufacturer: Сoilcraft; ManufacturerPartNumber: 1008CS-392X_E_; Value: 3,9мкГн
L17 L26 = ЧИП индуктивность 0805CS-681X: Value: 680нГн
L20 L21 = ЧИП индуктивность 0805CS-471X: Value: 470нГн
L22 L23 = ЧИП индуктивность 0805CS-121X: Value: 120нГн
L24 = ЧИП индуктивность 0805CS-152X: Value: 1.5мкГн
L25 = ЧИП индуктивность 0805CS-182X: Chip Inductors – 0805CS (2012); Manufacturer: Сoilcraft; ManufacturerPartNumber: 1812PS-683KLC; Value: 1,8мкГн
L27 L28 = ЧИП индуктивность 0805CS-222X: Value: 2.2мкГн
L29 = ЧИП индуктивность 0805CS-221XGL: Value: 220нГн
R1 R2 R5 R6 R8-R25 R31 R41-R43 R70 R72-R84 = Чип резистор 0402 100 Ом, 5%: as R53 on sheet RF_drv_v2; PackageReference: 0402; Value: 100
R3 R4 R7 = Чип резистор 0402 10 кОм, 5%: as R49 on sheet RF_drv_v2; PackageReference: 0402; Value: 10к
R67 = Чип резистор 1206 100 кОм, 5%: ЧИП-резистор; Manufacturer: ROHM; Tolerance: ±5%; TKE: 300 ppm/°С; PackageReference: 1206; Value: 100к
XW1 XW2 = Соединитель коаксиальный SMA-JR: as XW3 on sheet RF_drv_v2; Value: SMA-JR; ComponentLink1Description: datasheet; ComponentLink1URL: http://www.brownbear.ru/goods/2243.html

## Sheet RF_pwr_v2.SchDoc: Материнская плата
size 420 x 297 mm; DrawnBy: В.Титов; DocumentNumber: ХХХХ.468179.001 Э3; SheetNumber: 3; SheetTotal: 3; DocumentType: Схема электрическая принципиальная; Title2: Питание процессора
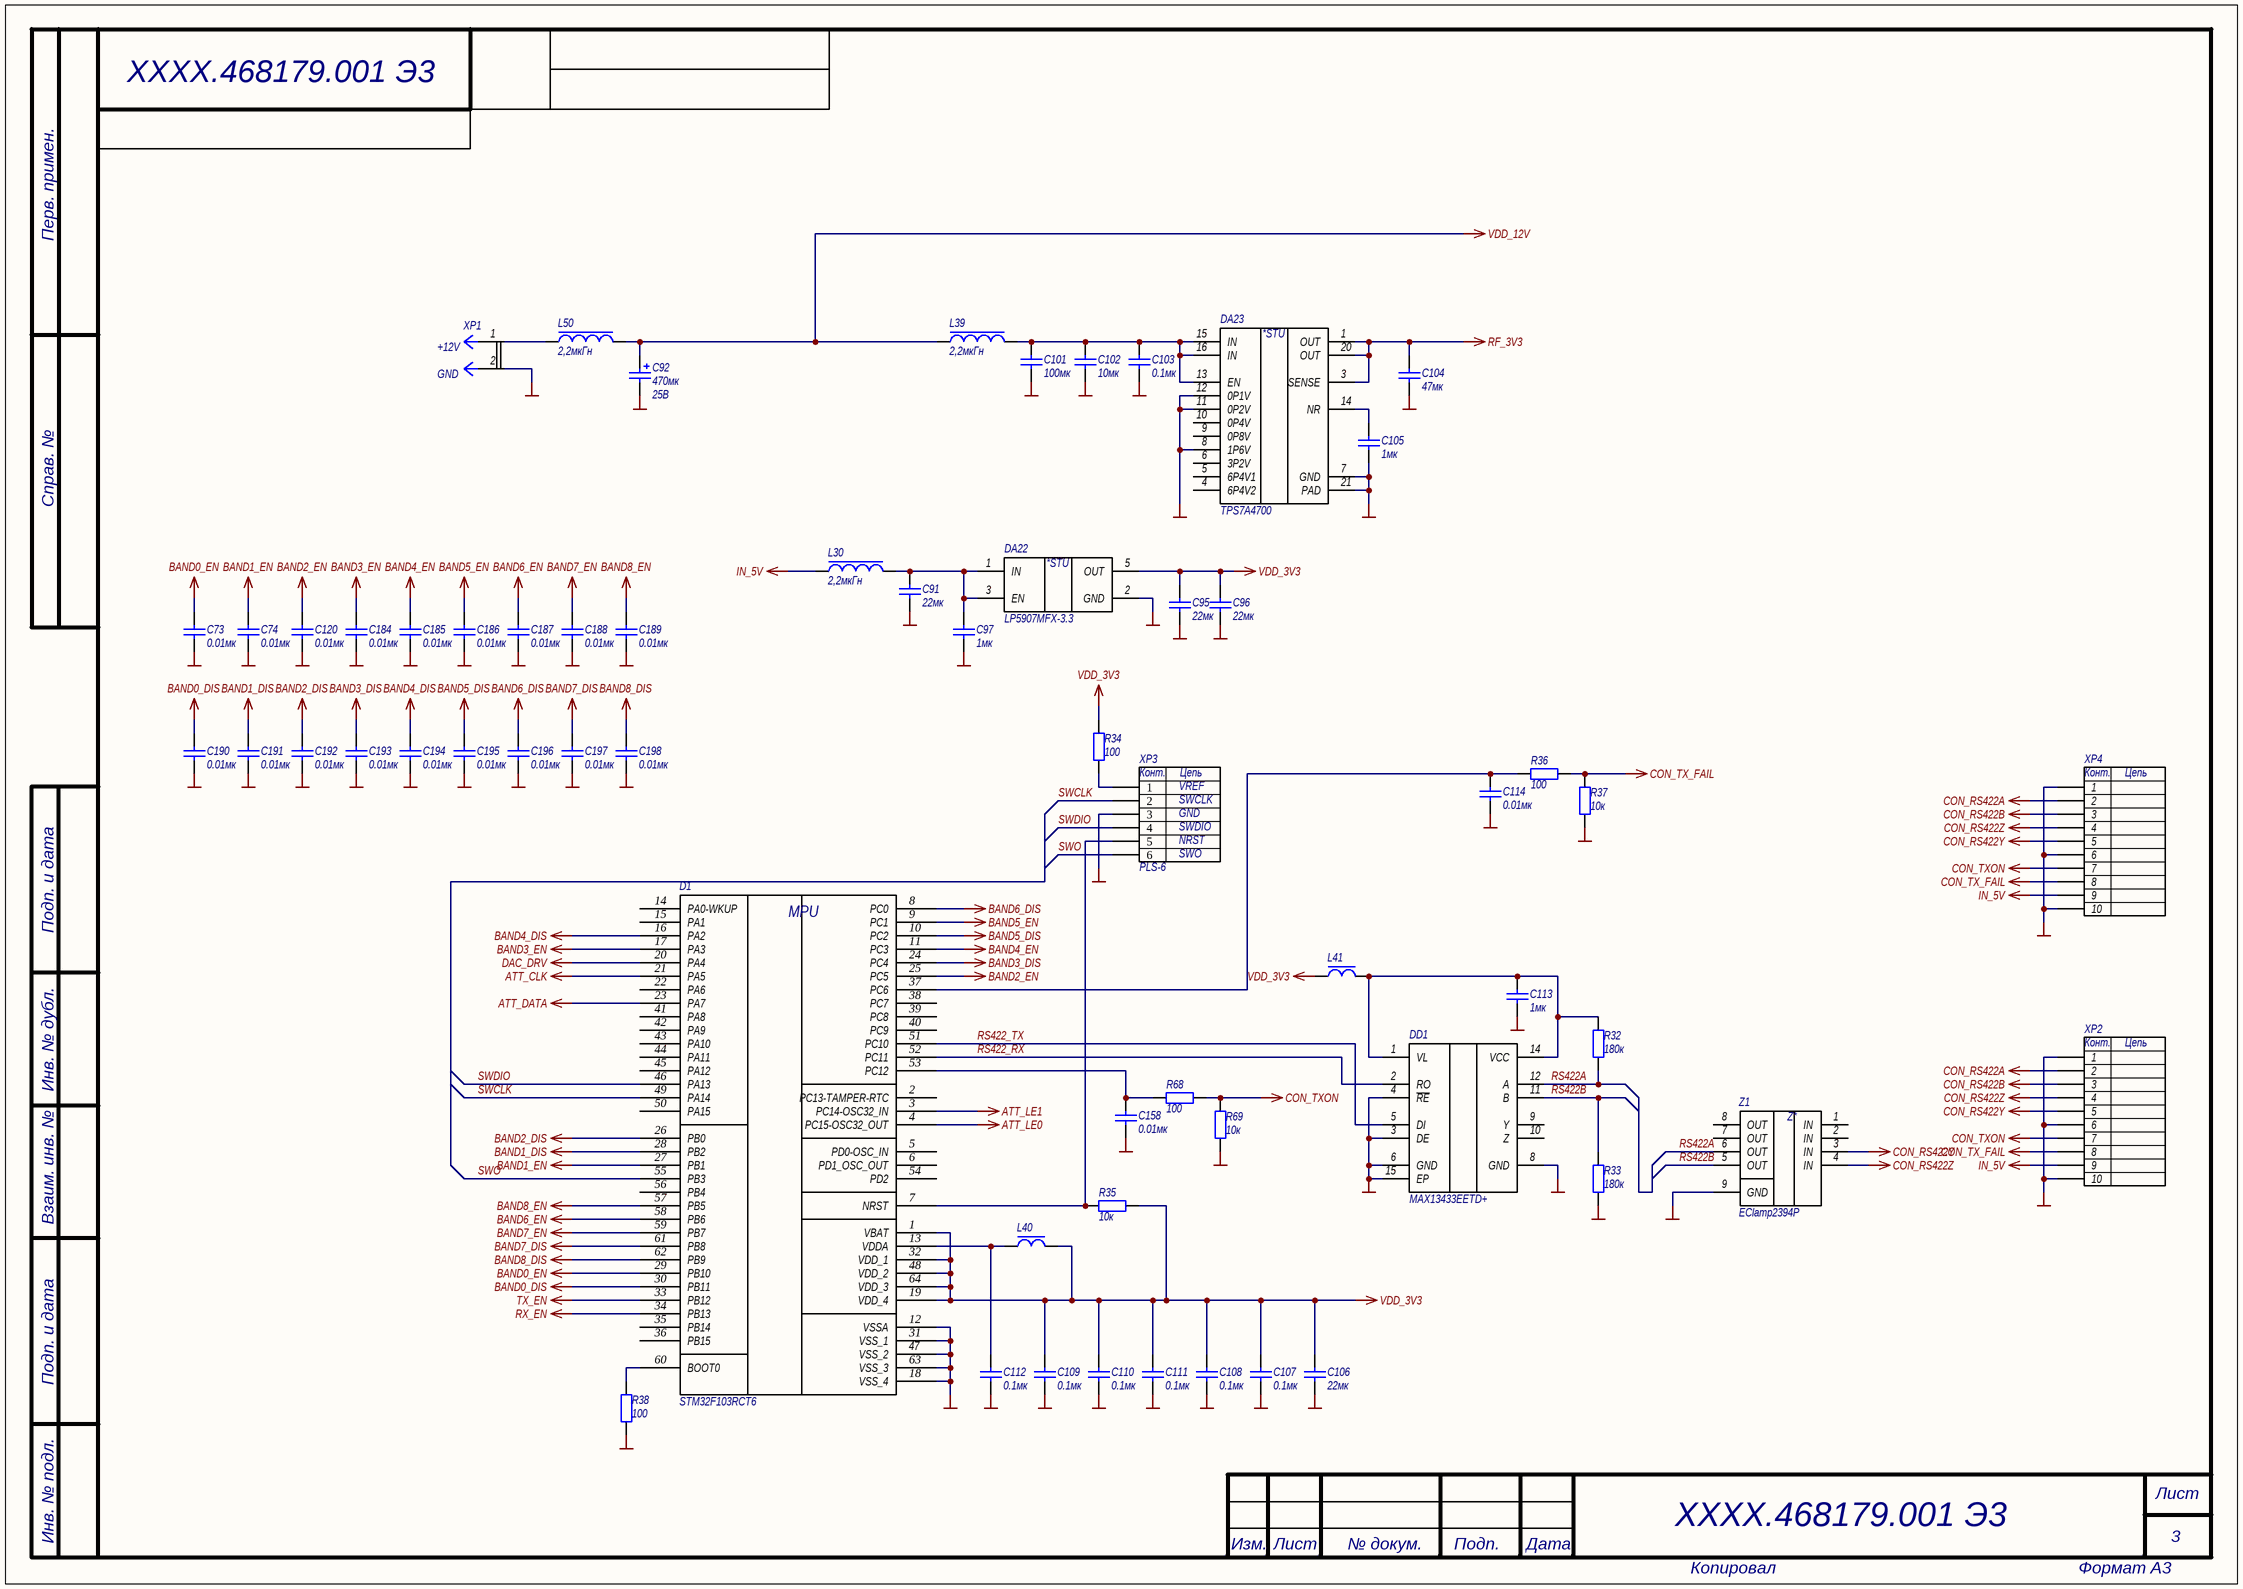
[diagram p2: RF_pwr_v2.SchDoc]

### Parts
C73  0.01мк  [CAPC1005X06N]
C74  0.01мк  [CAPC1005X06N]
C91  22мк  [CAPC2012X12L]
C92  Power/Voltage: 25В  [CAPAE116103X105N]  (hidden comment: 470мк)
C95  22мк  [CAPC2012X12L]
C96  22мк  [CAPC2012X12L]
C97  1мк  [CAPC1005X06N]
C101  100мк  [CAPC3216X19L]
C102  10мк  [CAPC1608X08L]
C103  0.1мк  [CAPC1005X06N]
C104  47мк  [CAPC2012X12L]
C105  1мк  [CAPC1005X06N]
C106  22мк  [CAPC2012X12L]
C107  0.1мк  [CAPC1005X06N]
C108  0.1мк  [CAPC1005X06N]
C109  0.1мк  [CAPC1005X06N]
C110  0.1мк  [CAPC1005X06N]
C111  0.1мк  [CAPC1005X06N]
C112  0.1мк  [CAPC1005X06N]
C113  1мк  [CAPC1005X06N]
C114  0.01мк  [CAPC1005X06N]
C120  0.01мк  [CAPC1005X06N]
C158  0.01мк  [CAPC1005X06N]
C184  0.01мк  [CAPC1005X06N]
C185  0.01мк  [CAPC1005X06N]
C186  0.01мк  [CAPC1005X06N]
C187  0.01мк  [CAPC1005X06N]
C188  0.01мк  [CAPC1005X06N]
C189  0.01мк  [CAPC1005X06N]
C190  0.01мк  [CAPC1005X06N]
C191  0.01мк  [CAPC1005X06N]
C192  0.01мк  [CAPC1005X06N]
C193  0.01мк  [CAPC1005X06N]
C194  0.01мк  [CAPC1005X06N]
C195  0.01мк  [CAPC1005X06N]
C196  0.01мк  [CAPC1005X06N]
C197  0.01мк  [CAPC1005X06N]
C198  0.01мк  [CAPC1005X06N]
D1  STM32F103RCT6  [QFP50P1200X1200X160-64N]
DA22  LP5907MFX-3.3  [SOT23-5AM]
DA23  TPS7A4700  [QFN65P500X500X100_HS-21L]
DD1  MAX13433EETD+  [SON40P300X80_HS-15L]
L30  2,2мкГн  [CSAB0420]
L39  2,2мкГн  [CSAB0420]
L40  BLM18PG121SN1D  [INDC1608X08L]  (value not drawn)
L41  BLM18PG121SN1D  [INDC1608X08L]  (value not drawn)
L50  2,2мкГн  [CSAB0420]
R32  180к  [RESC1005X06N]
R33  180к  [RESC1005X06N]
R34  100  [RESC1005X06N]
R35  10к  [RESC1005X06N]
R36  100  [RESC1005X06N]
R37  10к  [RESC1005X06N]
R38  100  [RESC1005X06N]
R68  100  [RESC1005X06N]
R69  10к  [RESC1005X06N]
XP1  XT30UPB-M  [XT30UPB-M]  (value not drawn)
XP2  FH12-10S-0.5SVA  [FH12-10S-0.5SH]  (value not drawn)
XP3  PLS-6  [HDR1X6]
XP4  FH12-10S-0.5SVA  [FH12-10S-0.5SH]  (value not drawn)
Z1  EClamp2394P  [SON50P160X65_HS-9N]

### Nets
ATT_CLK: D1.21(PA5)
ATT_DATA: D1.23(PA7)
ATT_LE0: D1.4(PC15-OSC32_OUT)
ATT_LE1: D1.3(PC14-OSC32_IN)
BAND0_DIS: C190.2 D1.30(PB11)
BAND0_EN: C73.2 D1.29(PB10)
BAND1_DIS: C191.2 D1.28(PB2)
BAND1_EN: C74.2 D1.27(PB1)
BAND2_DIS: C192.2 D1.26(PB0)
BAND2_EN: C120.2 D1.25(PC5)
BAND3_DIS: C193.2 D1.24(PC4)
BAND3_EN: C184.2 D1.17(PA3)
BAND4_DIS: C194.2 D1.16(PA2)
BAND4_EN: C185.2 D1.11(PC3)
BAND5_DIS: C195.2 D1.10(PC2)
BAND5_EN: C186.2 D1.9(PC1)
BAND6_DIS: C196.2 D1.8(PC0)
BAND6_EN: C187.2 D1.58(PB6)
BAND7_DIS: C197.2 D1.61(PB8)
BAND7_EN: C188.2 D1.59(PB7)
BAND8_DIS: C198.2 D1.62(PB9)
BAND8_EN: C189.2 D1.57(PB5)
CON_RS422A: XP2.2 XP4.2
CON_RS422B: XP2.3 XP4.3
CON_RS422Y: XP2.5 XP4.5 Z1.3(IN)
CON_RS422Z: XP2.4 XP4.4 Z1.4(IN)
CON_TX_FAIL: R36.1 R37.1 XP2.8 XP4.8
CON_TXON: R68.1 R69.1 XP2.7 XP4.7
DAC_DRV: D1.20(PA4)
GND: C73.1 C74.1 C91.1 C92.2 C95.1 C96.1 C97.1 C101.1 C102.1 C103.1 C104.1 C105.1 C106.1 C107.1 C108.1 C109.1 C110.1 C111.1 C112.1 C113.1 C114.1 C120.1 C158.1 C184.1 C185.1 C186.1 C187.1 C188.1 C189.1 C190.1 C191.1 C192.1 C193.1 C194.1 C195.1 C196.1 C197.1 C198.1 D1.12(VSSA) D1.18(VSS_4) D1.31(VSS_1) D1.47(VSS_2) D1.63(VSS_3) DA22.2(GND) DA23.7(GND) DA23.8(1P6V) DA23.11(0P2V) DA23.12(0P1V) DA23.21(PAD) DD1.3(DE) DD1.4(~{RE}) DD1.6(GND) DD1.8(GND) DD1.15(EP) R33.1 R37.2 R38.2 R69.2 XP1.2 XP2.1 XP2.6 XP2.10 XP3.3 XP4.1 XP4.6 XP4.10 Z1.9(GND)
IN_5V: L30.1 XP2.9 XP4.9
RF_3V3: C104.2 DA23.1(OUT) DA23.3(SENSE) DA23.20(OUT)
RX_EN: D1.34(PB13)
TX_EN: D1.33(PB12)
VDD_3V3: C95.2 C96.2 C106.2 C107.2 C108.2 C109.2 C110.2 C111.2 D1.1(VBAT) D1.19(VDD_4) D1.32(VDD_1) D1.48(VDD_2) D1.64(VDD_3) DA22.5(OUT) L40.2 L41.1 R34.1 R35.2
VDD_12V: C92.1 L39.1 L50.2
RS422_RX: D1.52(PC11) DD1.2(RO)
RS422_TX: D1.51(PC10) DD1.5(DI)
RS422A: DD1.12(A) R32.1 Z1.6(OUT)
RS422B: DD1.11(B) R33.2 Z1.5(OUT)
SWCLK: D1.49(PA14) XP3.2
SWDIO: D1.46(PA13) XP3.4
SWO: D1.55(PB3) XP3.6
NetC91_2: C91.2 C97.2 DA22.1(IN) DA22.3(EN) L30.2
NetC101_2: C101.2 C102.2 C103.2 DA23.13(EN) DA23.15(IN) DA23.16(IN) L39.2
NetC105_2: C105.2 DA23.14(NR)
NetC112_2: C112.2 D1.13(VDDA) L40.1
NetC113_2: C113.2 DD1.1(VL) DD1.14(VCC) L41.2 R32.2
NetC114_2: C114.2 D1.37(PC6) R36.2
NetC158_2: C158.2 D1.53(PC12) R68.2
NetD1_7: D1.7(NRST) R35.1 XP3.5
NetD1_60: D1.60(BOOT0) R38.1
NetL50_1: L50.1 XP1.1
NetR34_2: R34.2 XP3.1

Not connected (* = marked no-connect by the designer): D1 2(PC13-TAMPER-RTC) 5(PD0-OSC_IN) 6(PD1_OSC_OUT) 14(PA0-WKUP) 15(PA1) 22(PA6) 35(PB14) 36(PB15) 38(PC7) 39(PC8) 40(PC9) 41(PA8) 42(PA9) 43(PA10) 44(PA11) 45(PA12) 50(PA15) 54(PD2) 56(PB4); DA23 4(6P4V2) 5(6P4V1) 6(3P2V) 9(0P8V) 10(0P4V); DD1 9(Y) 10(Z); Z1 1(IN) 2(IN) 7(OUT) 8(OUT)

### Notes on the sheet
- (near XP1) GND
- (near XP1) +12V
- (near XP3) VREF
- (near XP3) SWCLK
- (near XP3) GND
- (near XP3) SWDIO
- (near XP3) NRST
- (near XP3) SWO
- Перв. примен.
- Справ. №
- Подп. и дата
- Инв. № дубл.
- Взаим. инв. №
- Инв. № подл.
- Лист
- Изм.
- № докум.
- Подп.
- Дата
- Копировал
- Формат А3
- (in symbol Микросхема LP5907MFX-3.3) *STU
- (in symbol Микросхема STM32F103RCT6) MPU
- (in symbol Микросхема TPS7A4700RGW) *STU
- (in symbol Соединитель FH12-10S-0.5SVA) Конт.; Цепь
- (in symbol Соединитель PLS-6) Конт.; Цепь
- (in symbol Фильтр EMI EClamp2394P) Z*

### Library data of the parts
C73 C74 C114 C120 C158 C184-C198 = Кер.ЧИП конд. 0402 0.01мкФ X7R 10%, 50В: as C124 on sheet RF_drv_v2; Value: 0.01мк
C91 C95 C96 C106 = Кер.ЧИП конд. 0805 22мкФ X5R 10% 16В: as C93 on sheet RF_drv_v2; Value: 22мк
C92 = Конденсатор гибридный SMD 470мкФ ±20% 25В: as C156 on sheet RF_drv_v2; Published: 8-Jun-2000; LatestRevisionDate: 29-May-2009; LatestRevisionNote: IPC-7351 Footprint Added.; Publisher: Altium Limited; PackageDescription: ZK series; PackageReference: ZK series; Value: 470мк
C97 C105 C113 = Кер.ЧИП конд. 0402 1мкФ X5R 10%, 10В: as C100 on sheet RF_drv_v2; PackageReference: 0402; Value: 1мк
C101 = Кер.ЧИП конд. 1206 100мкФ X5R 20% 6.3В: Кер. ЧИП-конденсатор; Manufacturer: Murata; ManufacturerPartNumber: GRM31CR60J107ME39L; Power/Voltage: 6.3В; TKE: X5R; Tolerance: ±20%; Value: 100мк
C102 = Кер.ЧИП конд. 0603 10мкФ X5R 20% 6.3В: Кер. ЧИП-конденсатор; Manufacturer: Murata; ManufacturerPartNumber: GRM188R61A106KE69D; Power/Voltage: 6.3В; TKE: X5R; Tolerance: ±20%; Value: 10мк
C103 C107-C112 = Кер.ЧИП конд. 0402 0.1мкФ X7R 10%, 16В: as C115 on sheet RF_drv_v2; PackageReference: 0402; Value: 0.1мк
C104 = Кер.ЧИП конд. 0805 47мкФ X5R 20% 10В: Кер. ЧИП-конденсатор; Manufacturer: Murata; ManufacturerPartNumber: GRM21BR61A476ME15L; Power/Voltage: 10В; TKE: X5R; Tolerance: ±20%; Value: 47мк
D1 = Микросхема STM32F103RCT6: Ultra-low-power 32-bit MCU ARM®-based Cortex®-M3, 128KB Flash, 16KB SRAM, 4KB EEPROM, LCD, USB, ADC, DAC; Manufacturer: STMicroelectronics; Published: 29-Jan-2009; Code_JEDEC: MS-026; ComponentLink1Description: Manufacturer Link; ComponentLink3Description: Packaging Specification; Value: STM32F103RCT6
DA22 = Микросхема LP5907MFX-3.3: 250-mA Ultra-Low-Noise, Low-IQ LDO; Manufacturer: TI; Value: LP5907MFX-3.3; ComponentLink1Description: datasheet; ComponentLink1URL: http://www.ti.com/lit/ds/symlink/lp5907.pdf
DA23 = Микросхема TPS7A4700RGW: as DA21 on sheet RF_drv_v2; Value: TPS7A4700; ComponentLink1Description: datasheet; ComponentLink1URL: http://www.ti.com/lit/ds/symlink/tps7a47.pdf
DD1 = Микросхема MAX13433EETD+: RS-422 Transceivers with Low-Voltage Logic Interface 16M; Manufacturer: Maxim; Value: MAX13433EETD+; ComponentLink1Description: datasheet; ComponentLink1URL: https://datasheets.maximintegrated.com/en/ds/MAX13430E-MAX13433E.pdf
L30 L39 L50 = ЧИП индуктивность CSAB0420-2R2M: as L42 on sheet RF_drv_v2; Value: 2,2мкГн
L40 L41 = ЧИП дроссель 0603 BLM18PG121SN1D: as L45 on sheet RF_drv_v2; ManufacturerPartNumber: BLM18PG121SN1D; Value: BLM18PG121SN1D
R32 R33 = Чип резистор 0402 180 кОм, 5%: ЧИП-резистор; Tolerance: ±5%; TKE: 100 ppm/°С; PackageReference: 0402; Value: 180к
R34 R36 R38 R68 = Чип резистор 0402 100 Ом, 5%: as R53 on sheet RF_drv_v2; PackageReference: 0402; Value: 100
R35 R37 R69 = Чип резистор 0402 10 кОм, 5%: as R49 on sheet RF_drv_v2; PackageReference: 0402; Value: 10к
XP1 = Соединитель XT30UPB-M: AMASS XT30UPB-M  5 mm; Value: XT30UPB-M
XP2 XP4 = Соединитель FH12-10S-0.5SVA: 0.5mm  Pitch FPC/FFC Connector FH12 Series; Manufacturer: Hirose; Value: FH12-10S-0.5SVA
XP3 = Соединитель PLS-6: Вилка штыревая 2.54мм 1x6 прямая тип1; LatestRevisionDate: 17-Jul-2002; LatestRevisionNote: Re-released for DXP Platform.; Publisher: Altium Limited; Value: PLS-6
Z1 = Фильтр EMI EClamp2394P: ESD/EMI Protection  for Color LCD Interfaces; Manufacturer: SEMTECH; PackageReference: SLP2116P8; Value: EClamp2394P

## Nets that join several sheets
ATT_CLK: RF_drv_v2 (R53.2), RF_in_v2 (R5.2), RF_pwr_v2 (D1.21)
ATT_DATA: RF_drv_v2 (R52.2), RF_in_v2 (R4.2), RF_pwr_v2 (D1.23)
ATT_LE0: RF_in_v2 (R6.2), RF_pwr_v2 (D1.4)
ATT_LE1: RF_drv_v2 (R54.2), RF_pwr_v2 (D1.3)
BAND0_DIS: RF_in_v2 (R13.2 R14.1), RF_pwr_v2 (C190.2 D1.30)
BAND0_EN: RF_in_v2 (R12.2 R15.1), RF_pwr_v2 (C73.2 D1.29)
BAND1_DIS: RF_in_v2 (R23.2 R24.1), RF_pwr_v2 (C191.2 D1.28)
BAND1_EN: RF_in_v2 (R19.2 R25.1), RF_pwr_v2 (C74.2 D1.27)
BAND2_DIS: RF_in_v2 (R72.2 R73.1), RF_pwr_v2 (C192.2 D1.26)
BAND2_EN: RF_in_v2 (R43.2 R74.1), RF_pwr_v2 (C120.2 D1.25)
BAND3_DIS: RF_in_v2 (R78.2 R79.1), RF_pwr_v2 (C193.2 D1.24)
BAND3_EN: RF_in_v2 (R76.2 R80.1), RF_pwr_v2 (C184.2 D1.17)
BAND4_DIS: RF_in_v2 (R82.2 R83.1), RF_pwr_v2 (C194.2 D1.16)
BAND4_EN: RF_in_v2 (R81.2 R84.1), RF_pwr_v2 (C185.2 D1.11)
BAND5_DIS: RF_in_v2 (R17.2 R18.1), RF_pwr_v2 (C195.2 D1.10)
BAND5_EN: RF_in_v2 (R16.2 R22.1), RF_pwr_v2 (C186.2 D1.9)
BAND6_DIS: RF_in_v2 (R41.2 R42.1), RF_pwr_v2 (C196.2 D1.8)
BAND6_EN: RF_in_v2 (R31.2 R70.1), RF_pwr_v2 (C187.2 D1.58)
BAND7_DIS: RF_in_v2 (R21.1 R75.2), RF_pwr_v2 (C197.2 D1.61)
BAND7_EN: RF_in_v2 (R20.2 R77.1), RF_pwr_v2 (C188.2 D1.59)
BAND8_DIS: RF_in_v2 (R10.2 R11.2), RF_pwr_v2 (C198.2 D1.62)
BAND8_EN: RF_in_v2 (R1.2 R2.2), RF_pwr_v2 (C189.2 D1.57)
BPF_OUT: RF_drv_v2 (T1.5), RF_in_v2 (9 pins)
DAC_DRV: RF_drv_v2 (R26.1), RF_pwr_v2 (D1.20)
GND: RF_drv_v2 (66 pins), RF_in_v2 (122 pins), RF_pwr_v2 (67 pins)
RF_3V3: RF_drv_v2 (L45.2), RF_in_v2 (L5.2), RF_pwr_v2 (C104.2 DA23.1 DA23.3 DA23.20)
RX_EN: RF_in_v2 (R8.2), RF_pwr_v2 (D1.34)
TX_EN: RF_drv_v2 (C209.1 VT6.1), RF_in_v2 (R9.2), RF_pwr_v2 (D1.33)
VDD_12V: RF_drv_v2 (L42.1 L49.1), RF_pwr_v2 (C92.1 L39.1 L50.2)